# Altium project UC-523.PrjPCB (part 2 of 3)

## Sheet LED_Driver - 4.SchDoc
size A3
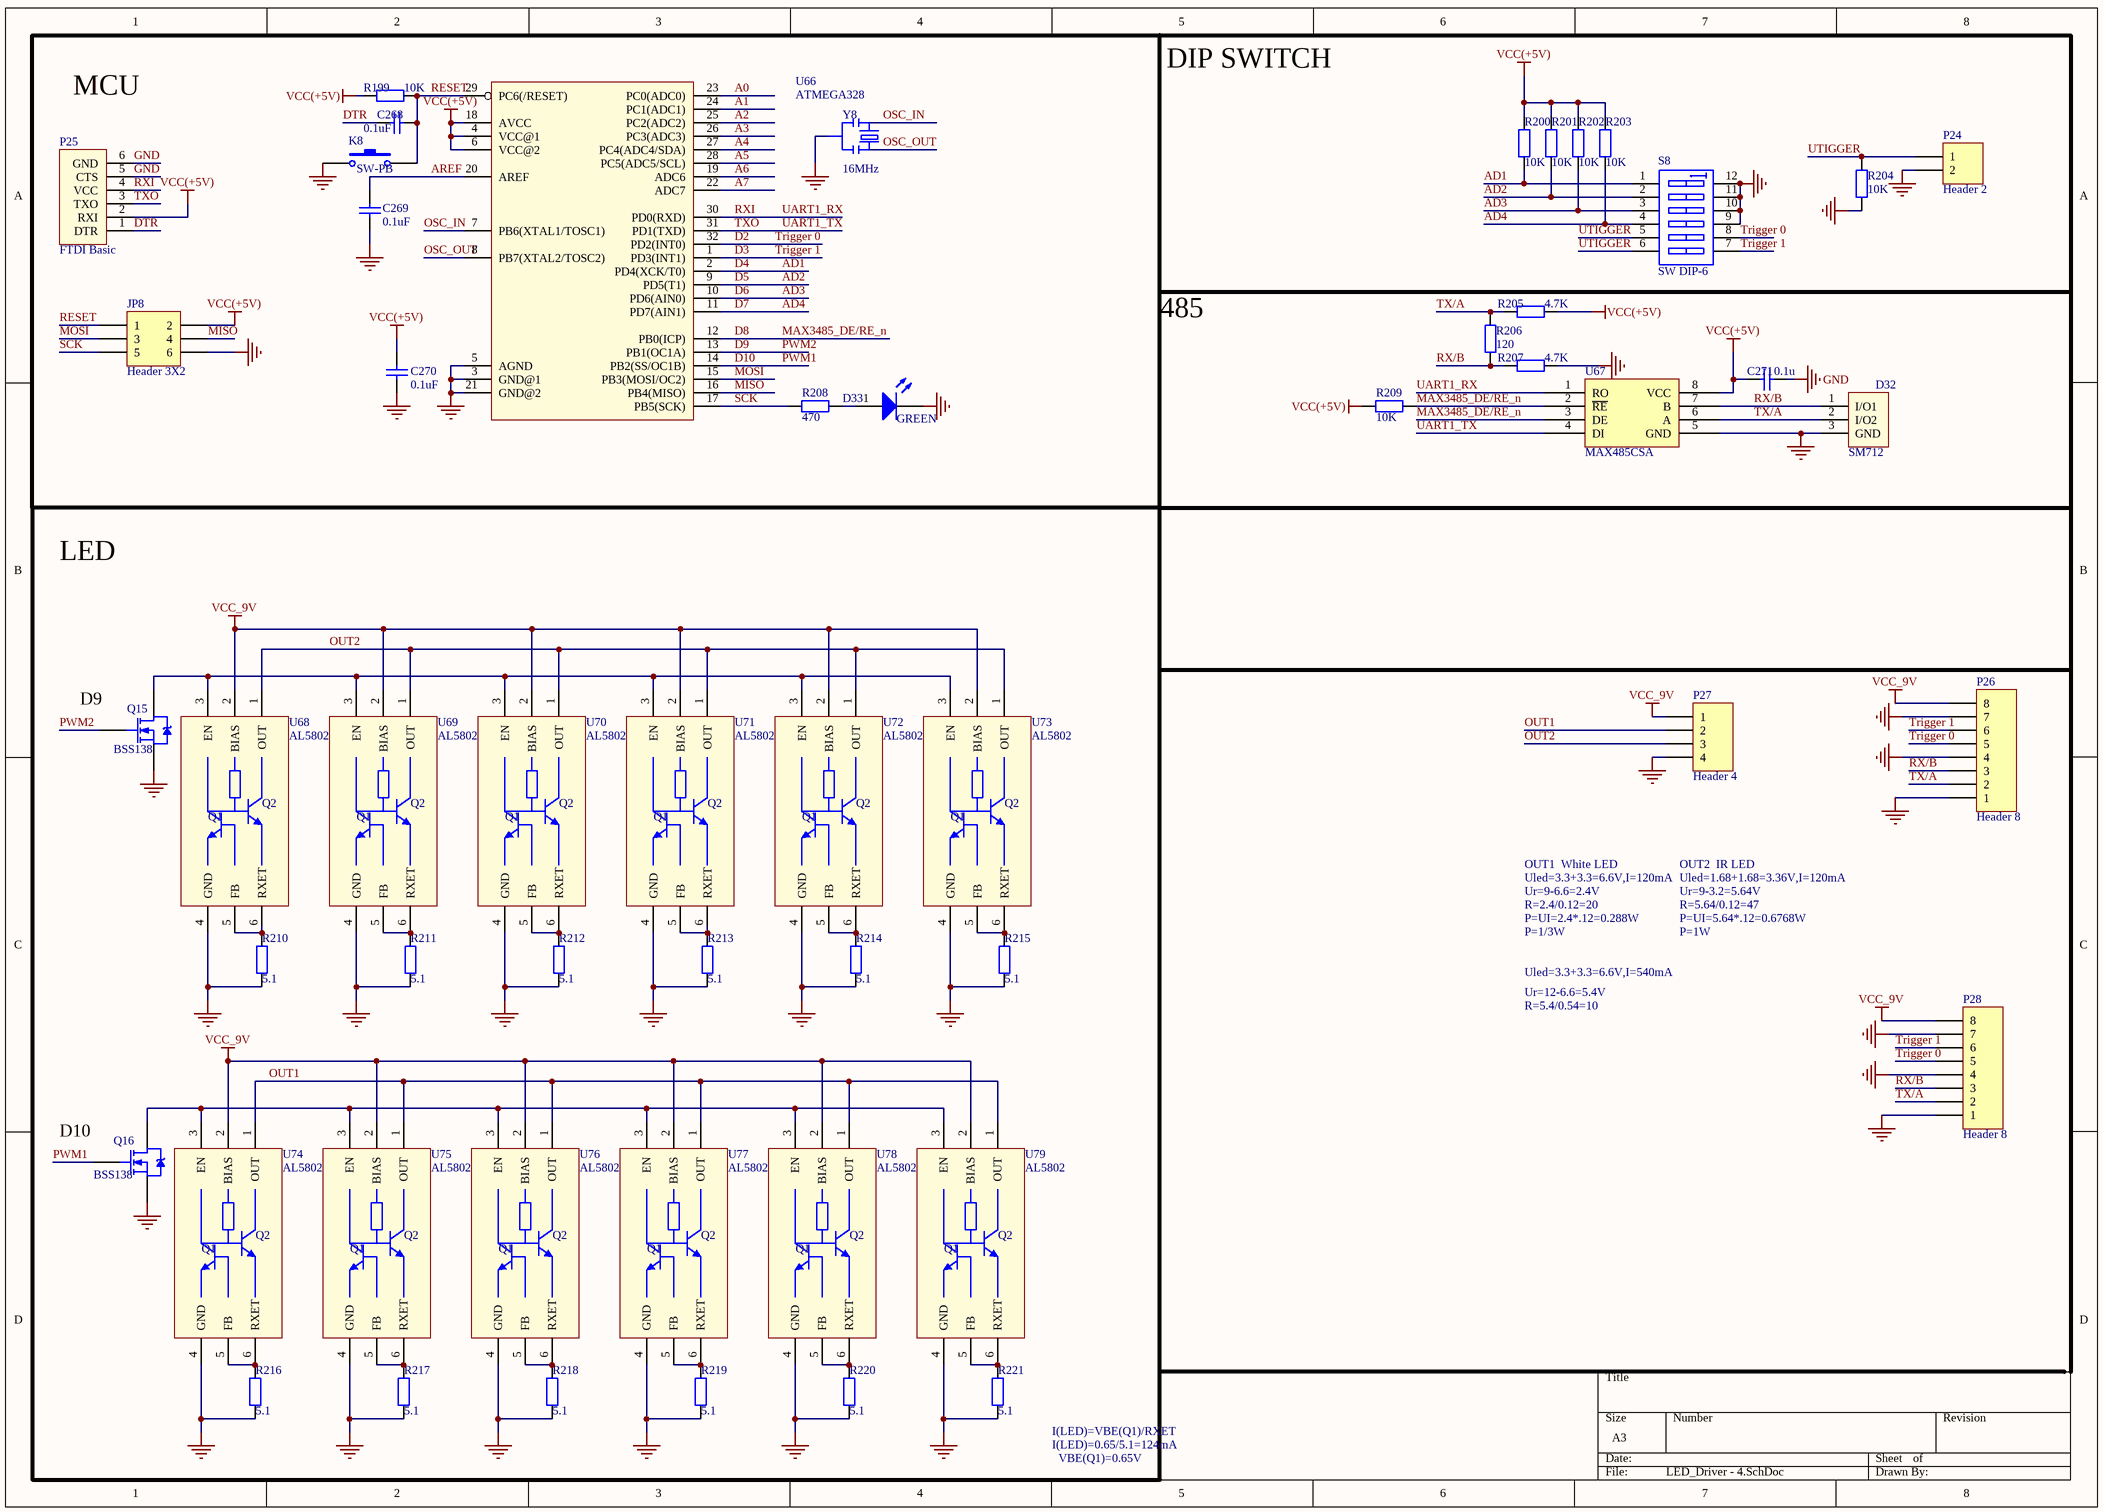
[diagram p5: LED_Driver - 4.SchDoc]

### Parts
C268  0.1uF  [C0603]
C269  0.1uF  [C0603]
C270  0.1uF  [C0603]
C271  0.1u  [C0603]
D32  SM712  [SOT23-3]
D33  GREEN  [LED0805]
JP8  Header 3X2  [MHDR1X6]
K8  SW-PB  [157SW]
P24  Header 2  [HDR1X2]
P25  FTDI Basic  [MHDR1X6]
P26  Header 8  [SH_1.25MM*8]
P27  Header 4  [SMT_1.25MM*4]
P28  Header 8  [SH_1.25MM*8]
Q15  BSS138  [SOT-23 (Standard)]
Q16  BSS138  [SOT-23 (Standard)]
R199  10K  [R0603]
R200  10K  [R0603]
R201  10K  [R0603]
R202  10K  [R0603]
R203  10K  [R0603]
R204  10K  [R0603]
R205  4.7K  [R0603]
R206  120  [R0603]
R207  4.7K  [R0603]
R208  470  [R0603]
R209  10K  [R0603]
R210  5.1  [R0603]
R211  5.1  [R0603]
R212  5.1  [R0603]
R213  5.1  [R0603]
R214  5.1  [R0603]
R215  5.1  [R0603]
R216  5.1  [R0603]
R217  5.1  [R0603]
R218  5.1  [R0603]
R219  5.1  [R0603]
R220  5.1  [R0603]
R221  5.1  [R0603]
S8  SW DIP-6  [DIP_SW_6WAY_SMD]
U66  ATMEGA328  [TQFP32-08]
U67  MAX485CSA  [SOIC-8]
U68  AL5802  [SOT26]
U69  AL5802  [SOT26]
U70  AL5802  [SOT26]
U71  AL5802  [SOT26]
U72  AL5802  [SOT26]
U73  AL5802  [SOT26]
U74  AL5802  [SOT26]
U75  AL5802  [SOT26]
U76  AL5802  [SOT26]
U77  AL5802  [SOT26]
U78  AL5802  [SOT26]
U79  AL5802  [SOT26]
Y8  16MHz  [RESONATOR-SMD]

### Blocks framed on the sheet
LED: Q15 Q16 R210-R221 U68-U79

### Nets
GND: C269.1 C270.2 C271.1 D32.3(GND) D33.2(K) JP8.6 K8.1 P24.2 P25.5(CTS) P25.6(GND) P26.1 P26.4 P26.7 P27.4 P28.1 P28.4 P28.7 Q15.S Q16.S R204.1 R207.1 R210.2 R211.2 R212.2 R213.2 R214.2 R215.2 R216.2 R217.2 R218.2 R219.2 R220.2 R221.2 S8.9(B4) S8.10(B3) S8.11(B2) S8.12(B1) U66.3(GND@1) U66.5(AGND) U66.21(GND@2) U67.5(GND) U68.4(GND) U69.4(GND) U70.4(GND) U71.4(GND) U72.4(GND) U73.4(GND) U74.4(GND) U75.4(GND) U76.4(GND) U77.4(GND) U78.4(GND) U79.4(GND) Y8.2
VCC(+5V): C270.1 C271.2 JP8.2 P25.2(RXI) R199.1 R200.1 R201.1 R202.1 R203.1 R205.1 R209.2 U66.4(VCC@1) U66.6(VCC@2) U66.18(AVCC) U67.8(VCC)
VCC_9V: P26.8 P27.1 P28.8 U68.2(BIAS) U69.2(BIAS) U70.2(BIAS) U71.2(BIAS) U72.2(BIAS) U73.2(BIAS) U74.2(BIAS) U75.2(BIAS) U76.2(BIAS) U77.2(BIAS) U78.2(BIAS) U79.2(BIAS)
A0: U66.23(PC0(ADC0))
A1: U66.24(PC1(ADC1))
A2: U66.25(PC2(ADC2))
A3: U66.26(PC3(ADC3))
A4: U66.27(PC4(ADC4/SDA))
A5: U66.28(PC5(ADC5/SCL))
A6: U66.19(ADC6)
A7: U66.22(ADC7)
AD1: R200.2 S8.1(A1) U66.2(PD4(XCK/T0))  [also labelled D4]
AD2: R201.2 S8.2(A2) U66.9(PD5(T1))  [also labelled D5]
AD3: R202.2 S8.3(A3) U66.10(PD6(AIN0))  [also labelled D6]
AD4: R203.2 S8.4(A4) U66.11(PD7(AIN1))  [also labelled D7]
AREF: C269.2 U66.20(AREF)
D2: P26.5 P28.5 S8.8(B5) U66.32(PD2(INT0))  [also labelled Trigger 0]
D3: P26.6 P28.6 S8.7(B6) U66.1(PD3(INT1))  [also labelled Trigger 1]
D8: R209.1 U66.12(PB0(ICP)) U67.2(~{RE}) U67.3(DE)  [also labelled MAX3485_DE/RE_n]
D9: Q15.G U66.13(PB1(OC1A))  [also labelled PWM2]
D10: Q16.G U66.14(PB2(SS/OC1B))  [also labelled PWM1]
DTR: C268.1 P25.1(DTR)
MISO: JP8.4 U66.16(PB4(MISO))
MOSI: JP8.3 U66.15(PB3(MOSI/OC2))
OSC_IN: U66.7(PB6(XTAL1/TOSC1)) Y8.3
OSC_OUT: U66.8(PB7(XTAL2/TOSC2)) Y8.1
OUT1: P27.2 U74.1(OUT) U75.1(OUT) U76.1(OUT) U77.1(OUT) U78.1(OUT) U79.1(OUT)
OUT2: P27.3 U68.1(OUT) U69.1(OUT) U70.1(OUT) U71.1(OUT) U72.1(OUT) U73.1(OUT)
RESET: C268.2 JP8.1 K8.2 R199.2 U66.29(PC6(/RESET))
RX/B: D32.1(I/O1) P26.3 P28.3 R206.2 R207.2 U67.7(B)
RXI: P25.4(VCC) U66.30(PD0(RXD)) U67.1(RO)  [also labelled UART1_RX]
SCK: JP8.5 R208.1 U66.17(PB5(SCK))
TX/A: D32.2(I/O2) P26.2 P28.2 R205.2 R206.1 U67.6(A)
TXO: P25.3(TXO) U66.31(PD1(TXD)) U67.4(DI)  [also labelled UART1_TX]
UTIGGER: P24.1 R204.2 S8.5(A5) S8.6(A6)
NetD33_1: D33.1(A) R208.2
NetQ15_D: Q15.D U68.3(EN) U69.3(EN) U70.3(EN) U71.3(EN) U72.3(EN) U73.3(EN)
NetQ16_D: Q16.D U74.3(EN) U75.3(EN) U76.3(EN) U77.3(EN) U78.3(EN) U79.3(EN)
NetR210_1: R210.1 U68.5(FB) U68.6(RXET)
NetR211_1: R211.1 U69.5(FB) U69.6(RXET)
NetR212_1: R212.1 U70.5(FB) U70.6(RXET)
NetR213_1: R213.1 U71.5(FB) U71.6(RXET)
NetR214_1: R214.1 U72.5(FB) U72.6(RXET)
NetR215_1: R215.1 U73.5(FB) U73.6(RXET)
NetR216_1: R216.1 U74.5(FB) U74.6(RXET)
NetR217_1: R217.1 U75.5(FB) U75.6(RXET)
NetR218_1: R218.1 U76.5(FB) U76.6(RXET)
NetR219_1: R219.1 U77.5(FB) U77.6(RXET)
NetR220_1: R220.1 U78.5(FB) U78.6(RXET)
NetR221_1: R221.1 U79.5(FB) U79.6(RXET)

### Notes on the sheet
- MCU
- DIP SWITCH
- 485
- (near Q15) D9
- Uled=3.3+3.3=6.6V,I=120mA
- OUT1  White LED
- R=2.4/0.12=20
- P=UI=2.4*.12=0.288W
- Ur=9-6.6=2.4V
- Uled=1.68+1.68=3.36V,I=120mA
- OUT2  IR LED
- R=5.64/0.12=47
- P=UI=5.64*.12=0.6768W
- Ur=9-3.2=5.64V
- P=1/3W
- Uled=3.3+3.3=6.6V,I=540mA
- Ur=12-6.6=5.4V
- P=1W
- R=5.4/0.54=10
- (near Q16) D10
- I(LED)=VBE(Q1)/RXET
- I(LED)=0.65/5.1=124mA
- VBE(Q1)=0.65V
- (in symbol AL5802) Q2; Q1

### Library data of the parts
C268-C270 = CAP SMT C100nF25V10%X7R: Capacitor; Voltage: 25V; iPartNumber: C100nF25V10%X7R; Value: 0.1uF
C271 = Cap: Capacitor; Value: 100pF; Published: 8-Jun-2000; LatestRevisionDate: 17-Jul-2002; LatestRevisionNote: Re-released for DXP Platform.; PackageReference: RAD-0.3; Publisher: Altium Limited
D33 = LED0: Typical INFRARED GaAs LED; Published: 8-Jun-2000; LatestRevisionDate: 08-Jul-2005; LatestRevisionNote: Mech Layer 1 removed.; PackageReference: LED-0; Publisher: Altium Limited
JP8 = Header 3X2: Header, 3-Pin, Dual row; LatestRevisionDate: 17-Jul-2002; LatestRevisionNote: Re-released for DXP Platform.; Publisher: Altium Limited
K8 = SW-PB: Switch; Published: 24-Mar-1999; LatestRevisionDate: 17-Jul-2002; LatestRevisionNote: Re-released for DXP Platform.; PackageReference: SPST-2; Publisher: Altium Limited; PackageDescription: Switch; 2 Leads
P24 = Header 2: Header, 2-Pin; LatestRevisionDate: 17-Jul-2002; LatestRevisionNote: Re-released for DXP Platform.; Publisher: Altium Limited
P25 = ARDUINO_SERIAL_PROGRAMPTH
P26 P28 = Header 8: Header, 8-Pin; LatestRevisionDate: 17-Jul-2002; LatestRevisionNote: Re-released for DXP Platform.; Publisher: Altium Limited
P27 = Header 4: Header, 4-Pin; LatestRevisionDate: 17-Jul-2002; LatestRevisionNote: Re-released for DXP Platform.; Publisher: Altium Limited
Q15 Q16 = NMOS: Manufacturer: Fairchild Semiconductor; Manufacturer Part Number: BSS123; FET Type: MOSFET N-Channel, Metal Oxide; FET Feature: Logic Level Gate; Drain to Source Voltage (Vdss): 100V; Current - Continuous Drain (Id) @ 25°C: 170mA (Ta); Rds On (Max) @ Id, Vgs: 6 Ohm @ 170mA, 10V; Vgs(th) (Max) @ Id: 2V @ 1mA; Gate Charge (Qg) @ Vgs: 2.5nC @ 10V; Input Capacitance (Ciss) @ Vds: 73pF @ 25V; Power - Max: 360mW; Supplier 1: Digi-Key; Supplier Part Number 1: BSS123NCT-ND; RoHS: RoHS Compliant; Category: Discrete Semiconductor Products; Stock 1: 163946; Pricing 1: 1=0.24, 10=0.216, 25=0.1556, 100=0.1211, 250=0.07612, 500=0.06484, 1000=0.04418 (USD); Packaging: Cut Tape (CT); Mounting Type: Surface Mount; Package / Case: TO-236-3, SC-59, SOT-23-3; Supplier Device Package: SOT-23; ComponentLink1URL: http://www.fairchildsemi.com/datasheets/BS/BSS123.pdf; ComponentLink1Description: http://www.fairchildsemi.com/datasheets/BS/BSS123.pdf
R199-R203 R205-R221 = Res2: Resistor
R204 = Res2: Resistor; Value: 1k; Published: 8-Jun-2000; LatestRevisionDate: 17-Jul-2002; LatestRevisionNote: Re-released for DXP Platform.; PackageReference: AXIAL-0.4; Publisher: Altium Limited
S8 = SW DIP-6: DIP Switch, 6 Position, SPST; Published: 24-Mar-1999; LatestRevisionDate: 17-Jul-2002; LatestRevisionNote: Re-released for DXP Platform.; PackageReference: DIP-12/SW; Publisher: Altium Limited
U66 = ATMEGA168
U67 = MAX3485CSA
Y8 = RESONATORSMD

## Sheet Cyusb3314_Power.SchDoc
size 386 x 284 mm
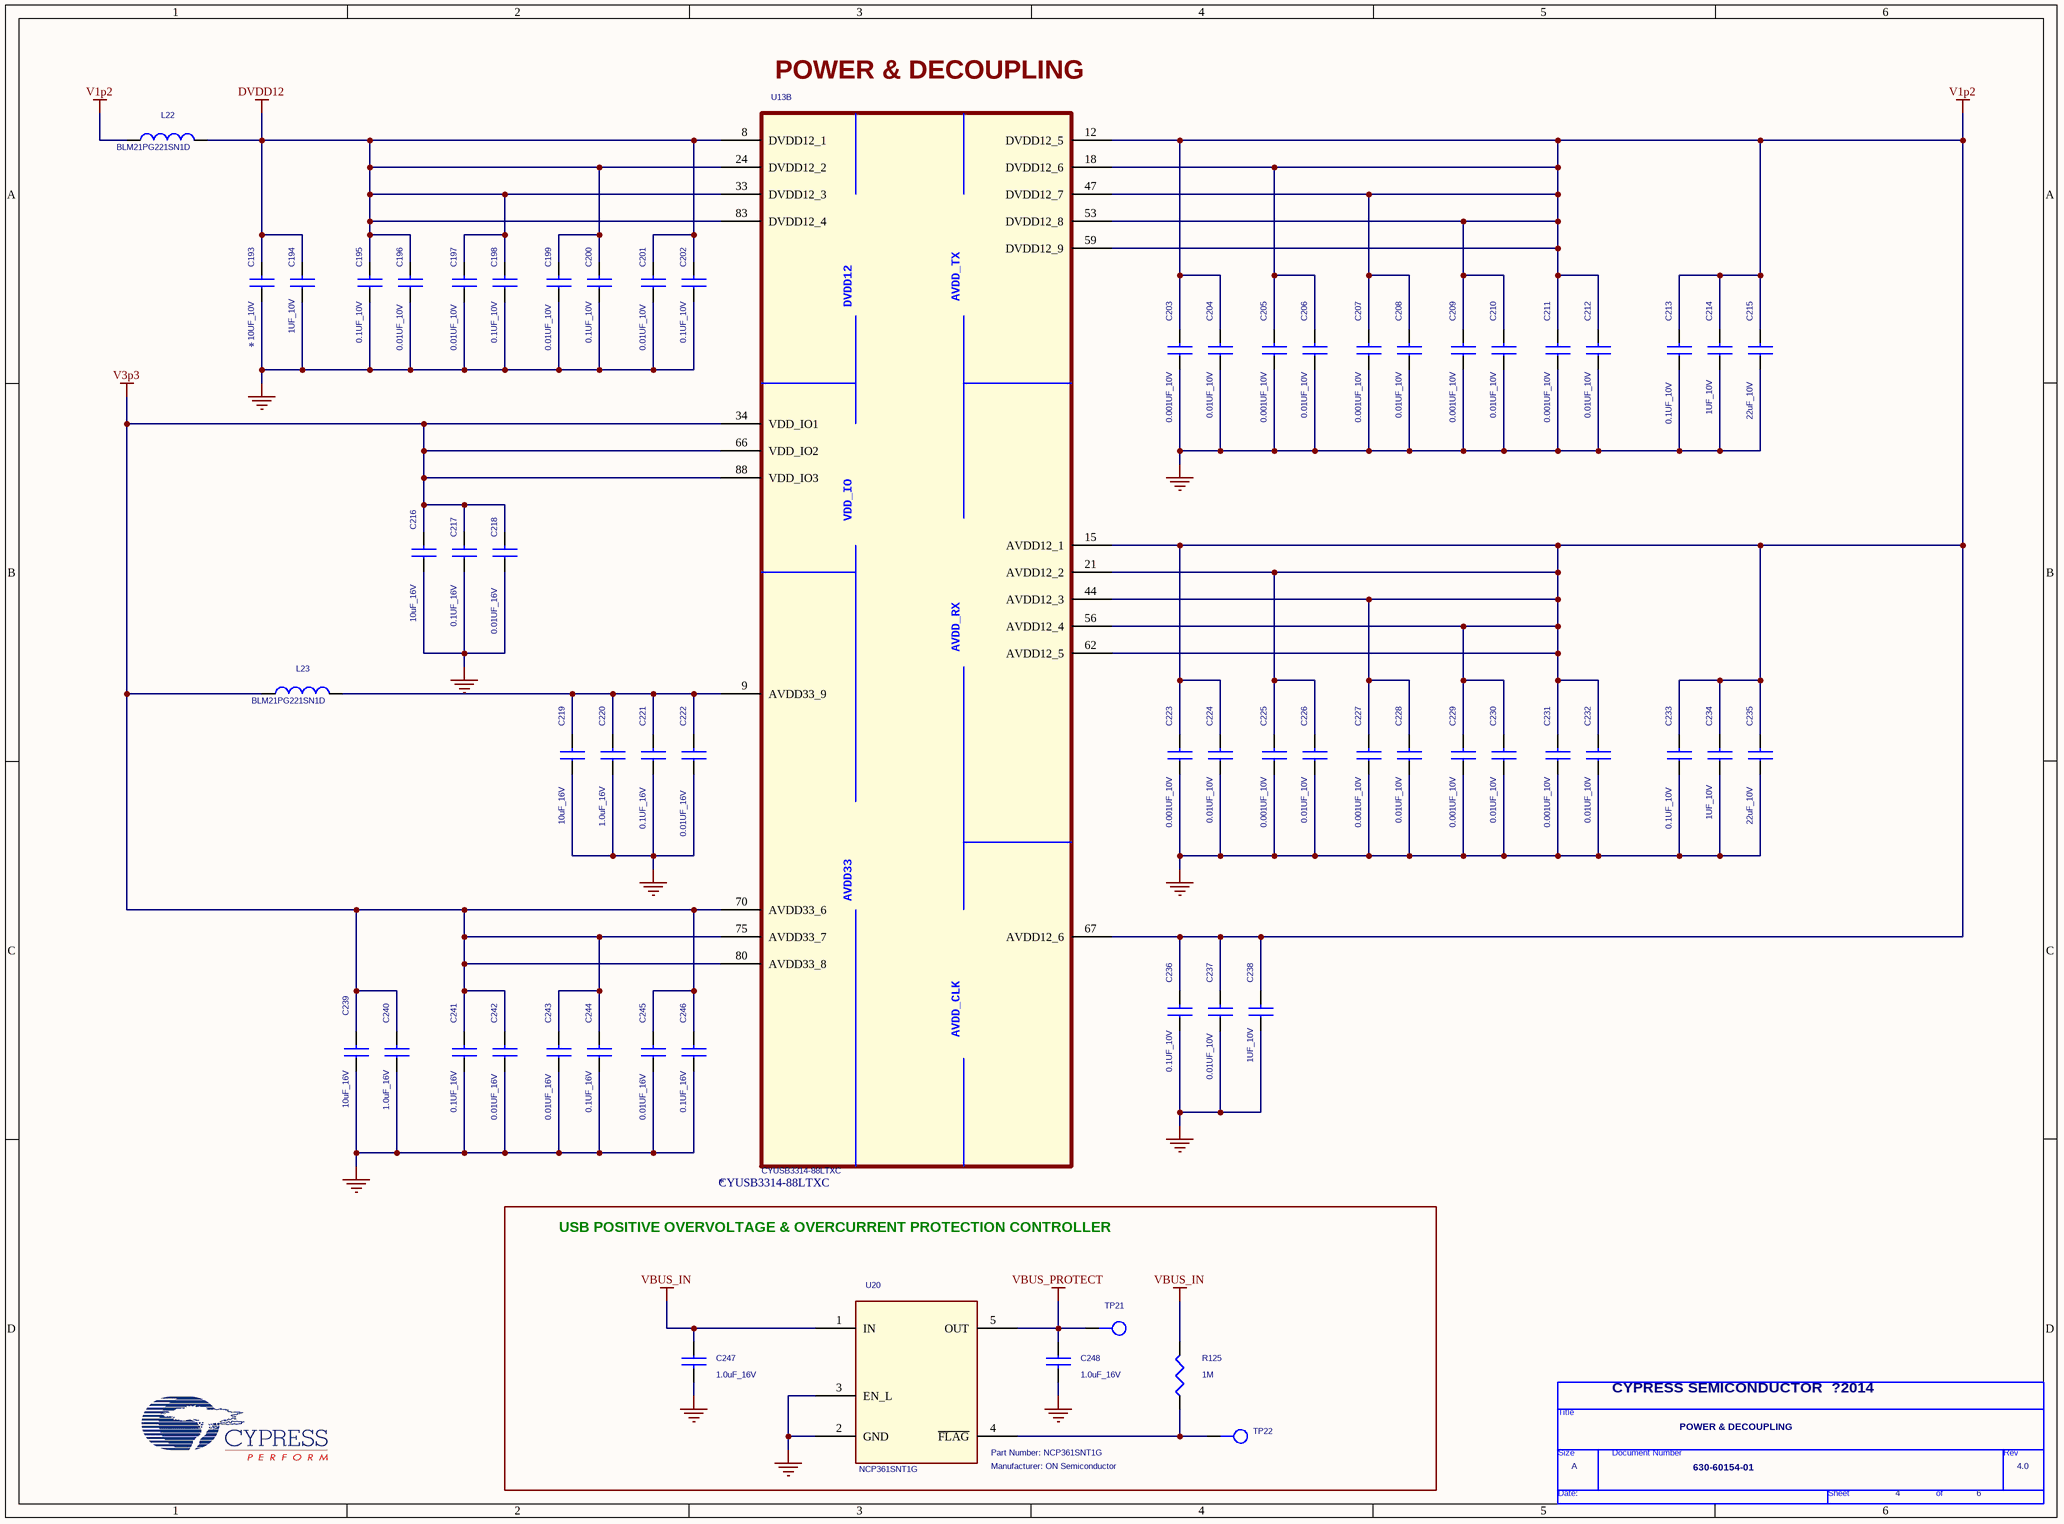
[diagram p6: Cyusb3314_Power.SchDoc]

### Parts
(Parts that share a designator on the sheet are numbered #1, #2 ... from top to bottom, then left to right.)
*#1  Page Count: 6  Page Number: 4  Page Size: A  Title: POWER & DECOUPLING  RevCode: 4.0  Doc: 630-60154-01  (hidden comment: TitleBlock0)  (graphical)
C193  10UF_10V  [CAPC1608X90M]
C194  1UF_10V  [CAPC1005X56M]
C195  0.1UF_10V  [CAPC1005X56M]
C196  0.01UF_10V  [CAPC1005X56M]
C197  0.01UF_10V  [CAPC1005X56M]
C198  0.1UF_10V  [CAPC1005X56M]
C199  0.01UF_10V  [CAPC1005X56M]
C200  0.1UF_10V  [CAPC1005X56M]
C201  0.01UF_10V  [CAPC1005X56M]
C202  0.1UF_10V  [CAPC1005X56M]
C203  0.001UF_10V  [CAPC1005X56M]
C204  0.01UF_10V  [CAPC1005X56M]
C205  0.001UF_10V  [CAPC1005X56M]
C206  0.01UF_10V  [CAPC1005X56M]
C207  0.001UF_10V  [CAPC1005X56M]
C208  0.01UF_10V  [CAPC1005X56M]
C209  0.001UF_10V  [CAPC1005X56M]
C210  0.01UF_10V  [CAPC1005X56M]
C211  0.001UF_10V  [CAPC1005X56M]
C212  0.01UF_10V  [CAPC1005X56M]
C213  0.1UF_10V  [CAPC1005X56M]
C214  1UF_10V  [CAPC1005X56M]
C215  22uF_10V  [CAPC1608X90M]
C216  10uF_16V  [CAPC1608X90M]
C217  0.1UF_16V  [CAPC1005X56M]
C218  0.01UF_16V  [CAPC1005X56M]
C219  10uF_16V  [CAPC1608X90M]
C220  1.0uF_16V  [CAPC1005X56M]
C221  0.1UF_16V  [CAPC1005X56M]
C222  0.01UF_16V  [CAPC1005X56M]
C223  0.001UF_10V  [CAPC1005X56M]
C224  0.01UF_10V  [CAPC1005X56M]
C225  0.001UF_10V  [CAPC1005X56M]
C226  0.01UF_10V  [CAPC1005X56M]
C227  0.001UF_10V  [CAPC1005X56M]
C228  0.01UF_10V  [CAPC1005X56M]
C229  0.001UF_10V  [CAPC1005X56M]
C230  0.01UF_10V  [CAPC1005X56M]
C231  0.001UF_10V  [CAPC1005X56M]
C232  0.01UF_10V  [CAPC1005X56M]
C233  0.1UF_10V  [CAPC1005X56M]
C234  1UF_10V  [CAPC1005X56M]
C235  22uF_10V  [CAPC1608X90M]
C236  0.1UF_10V  [CAPC1005X56M]
C237  0.01UF_10V  [CAPC1005X56M]
C238  1UF_10V  [CAPC1005X56M]
C239  10uF_16V  [CAPC1608X90M]
C240  1.0uF_16V  [CAPC1005X56M]
C241  0.1UF_16V  [CAPC1005X56M]
C242  0.01UF_16V  [CAPC1005X56M]
C243  0.01UF_16V  [CAPC1005X56M]
C244  0.1UF_16V  [CAPC1005X56M]
C245  0.01UF_16V  [CAPC1005X56M]
C246  0.1UF_16V  [CAPC1005X56M]
C247  1.0uF_16V  [CAPC1608X90M]
C248  1.0uF_16V  [CAPC1608X90M]
L22  BLM21PG221SN1D  [INDC2012X105M]
L23  BLM21PG221SN1D  [INDC2012X105M]
R125  1M  [RESC1005X40M]
TP21  TP_RED  [KEYSTONE_5000]  (value not drawn)
TP22  TP_YEL  [KEYSTONE_5000]  (value not drawn)
U13  CYUSB3314-88LTXC  [QFN40P1000X1000X100-89M]  (part B of 3)
U20  NCP361SNT1G  Manufacturer: ON Semiconductor  [SOP95P275X110-5M]

### Blocks framed on the sheet
USB POSITIVE OVERVOLTAGE & OVERCURRENT PROTECTION CONTROLLER: C247 C248 R125 TP21 TP22 U20

### Nets
DVDD12: C193.2 C194.2 C195.2 C196.2 C197.2 C198.2 C199.2 C200.2 C201.2 C202.2 L22.2 U13.8(DVDD12_1) U13.24(DVDD12_2) U13.33(DVDD12_3) U13.83(DVDD12_4)
GND: C193.1 C194.1 C195.1 C196.1 C197.1 C198.1 C199.1 C200.1 C201.1 C202.1 C203.1 C204.1 C205.1 C206.1 C207.1 C208.1 C209.1 C210.1 C211.1 C212.1 C213.1 C214.1 C215.1 C216.1 C217.1 C218.1 C219.1 C220.1 C221.1 C222.1 C223.1 C224.1 C225.1 C226.1 C227.1 C228.1 C229.1 C230.1 C231.1 C232.1 C233.1 C234.1 C235.1 C236.1 C237.1 C238.1 C239.1 C240.1 C241.1 C242.1 C243.1 C244.1 C245.1 C246.1 C247.2 C248.2 U20.2(GND) U20.3(EN_L)
V1p2: C203.2 C204.2 C205.2 C206.2 C207.2 C208.2 C209.2 C210.2 C211.2 C212.2 C213.2 C214.2 C215.2 C223.2 C224.2 C225.2 C226.2 C227.2 C228.2 C229.2 C230.2 C231.2 C232.2 C233.2 C234.2 C235.2 C236.2 C237.2 C238.2 L22.1 U13.12(DVDD12_5) U13.15(AVDD12_1) U13.18(DVDD12_6) U13.21(AVDD12_2) U13.44(AVDD12_3) U13.47(DVDD12_7) U13.53(DVDD12_8) U13.56(AVDD12_4) U13.59(DVDD12_9) U13.62(AVDD12_5) U13.67(AVDD12_6)
V3p3: C216.2 C217.2 C218.2 C239.2 C240.2 C241.2 C242.2 C243.2 C244.2 C245.2 C246.2 L23.1 U13.34(VDD_IO1) U13.66(VDD_IO2) U13.70(AVDD33_6) U13.75(AVDD33_7) U13.80(AVDD33_8) U13.88(VDD_IO3)  [project net VCC(+3.3V)]
VBUS_IN: C247.1 R125.2 U20.1(IN)
VBUS_PROTECT: C248.1 TP21.1(TP) U20.5(OUT)
NetC219_2: C219.2 C220.2 C221.2 C222.2 L23.2 U13.9(AVDD33_9)
NetR125_1: R125.1 TP22.1(TP) U20.4(~{FLAG})

### Notes on the sheet
- POWER & DECOUPLING
- CYPRESS SEMICONDUCTOR  ?2014
- (in symbol CYUSB3314-88LTXC_2, part B) AVDD_TX; DVDD12; VDD_IO; AVDD_RX; AVDD33; AVDD_CLK
- (in symbol TitleBlock0) Title; Size; Document Number; Rev; Date:; Sheet; of

### Library data of the parts
C193-C246 = CAPACITOR NON-POL: Manufacturer: *; Part Number: *
  C196: Decription: *
C247 C248 = CAP: CAP - CER, 1uF, 10V, +/-10%, X5R, 0402; Part Class: CAPACITORS; Num Pins: 2; Item Num: P03-15479R; RoHS Compliant: Yes; Lead Free Status: Yes
L22 L23 = INDUCTOR: FERRITE CHIP 220 OHM 2A 0805; Manufacturer: Murata; DEVICE: L4; Part Number: BLM21PG221SN1D; Lead Free: YES
R125 = R: RES 1.00M OHM 1/10W 1% 0402 SMD; Manufacturer: Panasonic; Part Number: ERJ-2RKF1004X
TP21 = TP: TEST POINT PC MINI .040"D RED; PART_NUMBER: 5000; Manufacturer: Keystone
TP22 = TP: TEST POINT PC MINI .040"D RED; Manufacturer: Keystone; PART_NUMBER: 5000
U13 = CYUSB3314-88LTXC_2: Manufacturer: *; Part Number: CYUSB3314-88LTXC
U20 = NCP361SNT1G_0: IC USB POS OVP/OC_TSOP5; Part Number: NCP361SNT1G
*#1 = TitleBlock0: Page Create Date: March  8, 1995

## Sheet Cyusb3314_Interface.SchDoc
size 401 x 330 mm
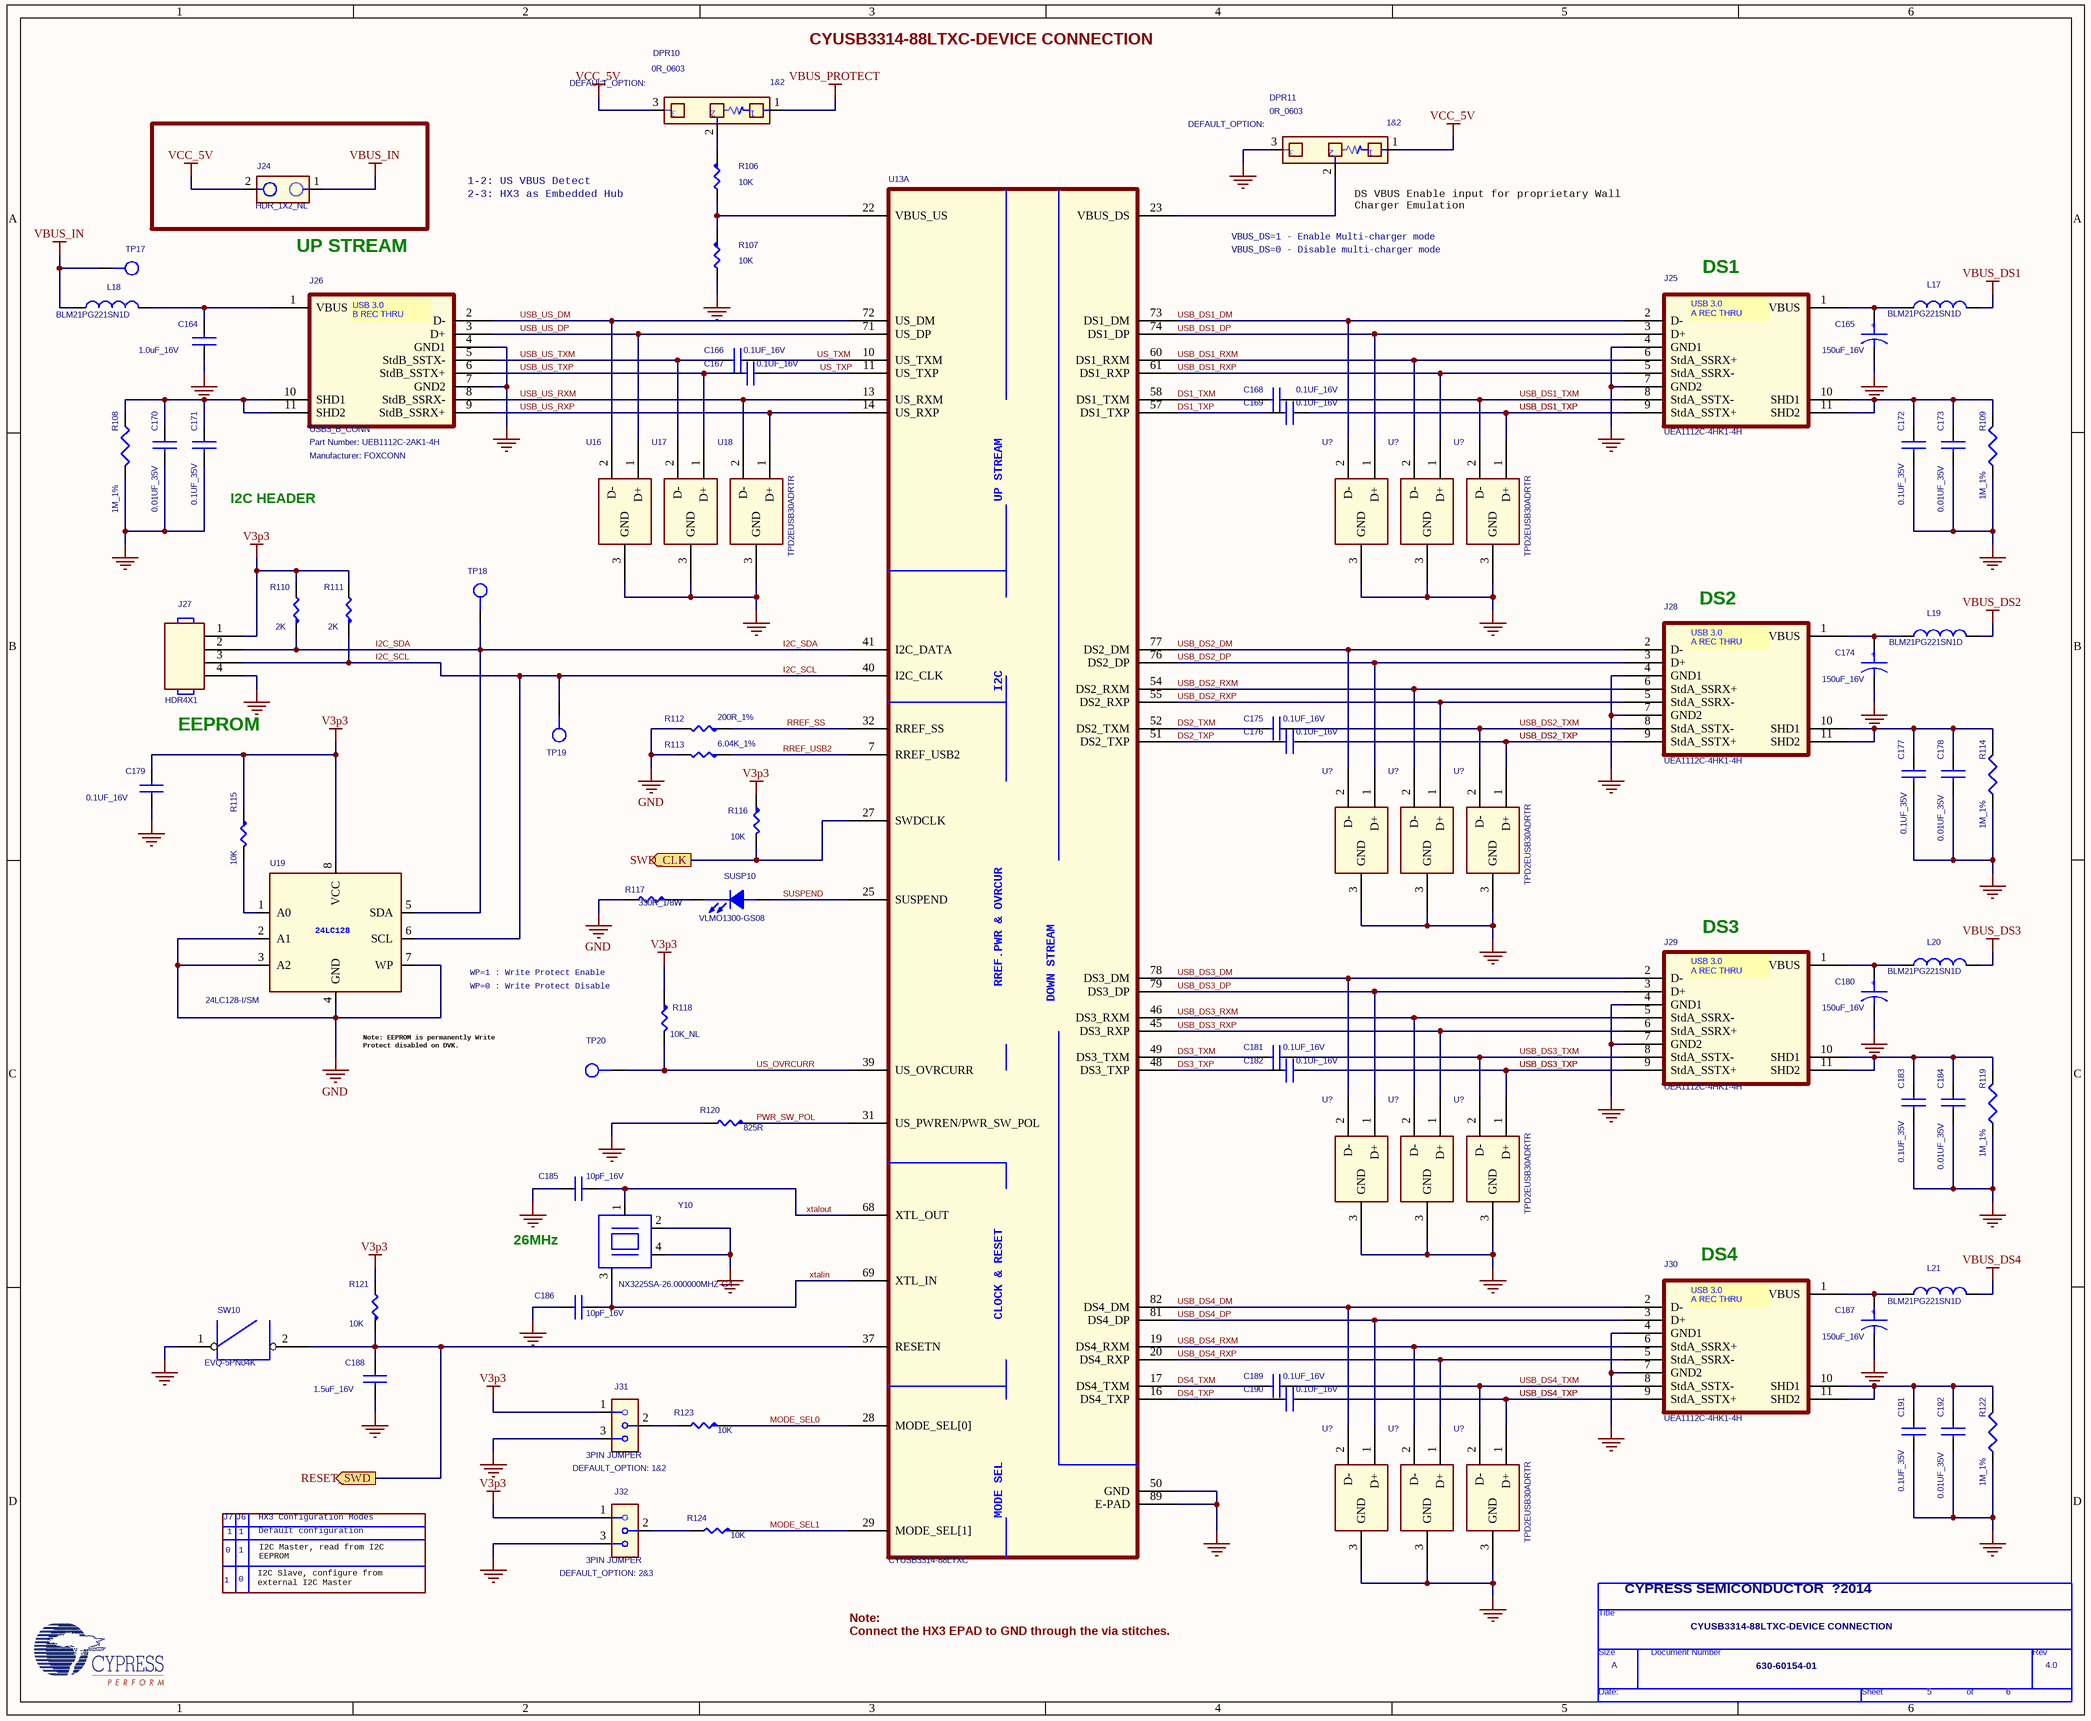
[diagram p7: Cyusb3314_Interface.SchDoc]

### Parts
(Parts that share a designator on the sheet are numbered #1, #2 ... from top to bottom, then left to right.)
*#2  Page Count: 6  Page Number: 5  Page Size: A  Title: CYUSB3314-88LTXC-DEVICE CONNECTION  RevCode: 4.0  Doc: 630-60154-01  (hidden comment: TitleBlock0)  (graphical)
C164  1.0uF_16V  [CAPC1005X56M]
C165  150uF_16V  [CAPAE660X800M]
C166  0.1UF_16V  [CAPC1005X56M]
C167  0.1UF_16V  [CAPC1005X56M]
C168  0.1UF_16V  [CAPC1005X56M]
C169  0.1UF_16V  [CAPC1005X56M]
C170  0.01UF_35V  [CAPC1005X55M]
C171  0.1UF_35V  [CAPC1005X55M]
C172  0.1UF_35V  [CAPC1005X55M]
C173  0.01UF_35V  [CAPC1005X55M]
C174  150uF_16V  [CAPAE660X800M]
C175  0.1UF_16V  [CAPC1005X56M]
C176  0.1UF_16V  [CAPC1005X56M]
C177  0.1UF_35V  [CAPC1005X55M]
C178  0.01UF_35V  [CAPC1005X55M]
C179  0.1UF_16V  [CAPC1005X56M]
C180  150uF_16V  [CAPAE660X800M]
C181  0.1UF_16V  [CAPC1005X56M]
C182  0.1UF_16V  [CAPC1005X56M]
C183  0.1UF_35V  [CAPC1005X55M]
C184  0.01UF_35V  [CAPC1005X55M]
C185  10pF_16V  [CAPC1608X90M]
C186  10pF_16V  [CAPC1608X90M]
C187  150uF_16V  [CAPAE660X800M]
C188  1.5uF_16V  [CAPC1608X90M]
C189  0.1UF_16V  [CAPC1005X56M]
C190  0.1UF_16V  [CAPC1005X56M]
C191  0.1UF_35V  [CAPC1005X55M]
C192  0.01UF_35V  [CAPC1005X55M]
DPR10  0R_0603  Mounting Status: 1&2  [RC0603_3P]
DPR11  0R_0603  Mounting Status: 1&2  [RC0603_3P]
J24  HDR_1X2_NL  [SAMTEC_TSW-102-08-G-S]
J25  UEA1112C-4HK1-4H  [FOXCONN_UEA1112C-4HK1-4H]
J26  USB3_B_CONN  Manufacturer: FOXCONN  [FOXCONN_UEB1112C-2AK1-4H]
J27  HDR4X1  [SAMTEC_TSW-104-08-G-S]
J28  UEA1112C-4HK1-4H  [FOXCONN_UEA1112C-4HK1-4H]
J29  UEA1112C-4HK1-4H  [FOXCONN_UEA1112C-4HK1-4H]
J30  UEA1112C-4HK1-4H  [FOXCONN_UEA1112C-4HK1-4H]
J31  3PIN JUMPER  DEFAULT_OPTION: 1&2  [TE_3-644456-3]
J32  3PIN JUMPER  DEFAULT_OPTION: 2&3  [TE_3-644456-3]
L17  BLM21PG221SN1D  [INDC2012X105M]
L18  BLM21PG221SN1D  [INDC2012X105M]
L19  BLM21PG221SN1D  [INDC2012X105M]
L20  BLM21PG221SN1D  [INDC2012X105M]
L21  BLM21PG221SN1D  [INDC2012X105M]
R106  10K  [RESC1005X40M]
R107  10K  [RESC1005X40M]
R108  1M_1%  [RESC1608X55M]
R109  1M_1%  [RESC1608X55M]
R110  2K  [RESC1608X55M]
R111  2K  [RESC1608X55M]
R112  200R_1%  [RESC1608X50M]
R113  6.04K_1%  [RESC1608X55M_A]
R114  1M_1%  [RESC1608X55M]
R115  10K  [RESC1608X55M]
R116  10K  [RESC1005X40M]
R117  330R_1/8W  [RESC1608X50M]
R118  10K_NL  [RESC1005X40M]
R119  1M_1%  [RESC1608X55M]
R120  825R  [RESC1005X40M]
R121  10K  [RESC1608X55M]
R122  1M_1%  [RESC1608X55M]
R123  10K  [RESC1005X40M]
R124  10K  [RESC1005X40M]
SUSP10  VLMO1300-GS08  [LEDC1608X80M]
SW10  EVQ-5PN04K  [SW_EVQ-5PN04K]
TP17  TP_RED  [KEYSTONE_5000]  (value not drawn)
TP18  TP_YEL  [KEYSTONE_5000]  (value not drawn)
TP19  TP_YEL  [KEYSTONE_5000]  (value not drawn)
TP20  TP_YEL  [KEYSTONE_5000]  (value not drawn)
U13  CYUSB3314-88LTXC  [QFN40P1000X1000X100-89M]  (part A of 3)
U16  TPD2EUSB30ADRTR  [SOTFL35P100X50-3M]  (value not drawn)
U17  TPD2EUSB30ADRTR  [SOTFL35P100X50-3M]  (value not drawn)
U18  TPD2EUSB30ADRTR  [SOTFL35P100X50-3M]
U19  24LC128-I/SM  [SOIC127P790X203-8M]
U?#1  TPD2EUSB30ADRTR  [SOTFL35P100X50-3M]  (value not drawn)
U?#2  TPD2EUSB30ADRTR  [SOTFL35P100X50-3M]  (value not drawn)
U?#3  TPD2EUSB30ADRTR  [SOTFL35P100X50-3M]
U?#4  TPD2EUSB30ADRTR  [SOTFL35P100X50-3M]  (value not drawn)
U?#5  TPD2EUSB30ADRTR  [SOTFL35P100X50-3M]  (value not drawn)
U?#6  TPD2EUSB30ADRTR  [SOTFL35P100X50-3M]
U?#7  TPD2EUSB30ADRTR  [SOTFL35P100X50-3M]  (value not drawn)
U?#8  TPD2EUSB30ADRTR  [SOTFL35P100X50-3M]  (value not drawn)
U?#9  TPD2EUSB30ADRTR  [SOTFL35P100X50-3M]
U?#10  TPD2EUSB30ADRTR  [SOTFL35P100X50-3M]  (value not drawn)
U?#11  TPD2EUSB30ADRTR  [SOTFL35P100X50-3M]  (value not drawn)
U?#12  TPD2EUSB30ADRTR  [SOTFL35P100X50-3M]
Y10  NX3225SA-26.000000MHZ-G4  [OSCCC250X320X70-4M]

### Ports
RESET_SWD (out), SWD_CLK (out)

### Nets
GND: C164.1 C165.2 C170.2 C171.2 C172.2 C173.2 C174.2 C177.2 C178.2 C179.1 C180.2 C183.2 C184.2 C185.1 C186.1 C187.2 C188.2 C191.2 C192.2 DPR11.3 J25.4(GND1) J25.7(GND2) J26.4(GND1) J26.7(GND2) J27.4 J28.4(GND1) J28.7(GND2) J29.4(GND1) J29.7(GND2) J30.4(GND1) J30.7(GND2) J31.3 J32.3 R107.2 R108.2 R109.2 R112.2 R113.2 R114.2 R117.2 R119.2 R120.2 R122.2 SW10.1 U13.50(GND) U13.89(E-PAD) U16.3(GND) U17.3(GND) U18.3(GND) U19.2(A1) U19.3(A2) U19.4(GND) U19.7(WP) U?#1.3(GND) U?#2.3(GND) U?#3.3(GND) U?#4.3(GND) U?#5.3(GND) U?#6.3(GND) U?#7.3(GND) U?#8.3(GND) U?#9.3(GND) U?#10.3(GND) U?#11.3(GND) U?#12.3(GND) Y10.2 Y10.4
V3p3: C179.2 J27.1 J31.1 J32.1 R110.2 R111.2 R115.1 R116.1 R118.1 R121.2 U19.8(VCC)  [project net VCC(+3.3V)]
VBUS_DS1: L17.1
VBUS_DS2: L19.1
VBUS_DS3: L20.1
VBUS_DS4: L21.1
VBUS_IN: J24.1 L18.1 TP17.1(TP)
VBUS_PROTECT: DPR10.1
VCC_5V: DPR10.3 DPR11.1 J24.2  [project net VCC(+5V)]
DS1_TXM: C168.2 U13.58(DS1_TXM)
DS1_TXP: C169.2 U13.57(DS1_TXP)
DS2_TXM: C175.2 U13.52(DS2_TXM)
DS2_TXP: C176.2 U13.51(DS2_TXP)
DS3_TXM: C181.2 U13.49(DS3_TXM)
DS3_TXP: C182.2 U13.48(DS3_TXP)
DS4_TXM: C189.2 U13.17(DS4_TXM)
DS4_TXP: C190.2 U13.16(DS4_TXP)
I2C_SCL: J27.3 R111.1 TP19.1(TP) U13.40(I2C_CLK) U19.6(SCL)
I2C_SDA: J27.2 R110.1 TP18.1(TP) U13.41(I2C_DATA) U19.5(SDA)
MODE_SEL0: R123.1 U13.28(MODE_SEL[0])
MODE_SEL1: R124.1 U13.29(MODE_SEL[1])
PWR_SW_POL: R120.1 U13.31(US_PWREN/PWR_SW_POL)
RREF_SS: R112.1 U13.32(RREF_SS)
RREF_USB2: R113.1 U13.7(RREF_USB2)
SUSPEND: SUSP10.1(ANODE) U13.25(SUSPEND)
US_OVRCURR: R118.2 TP20.1(TP) U13.39(US_OVRCURR)
US_TXM: C166.1 U13.10(US_TXM)
US_TXP: C167.1 U13.11(US_TXP)
USB_DS1_DM: J25.2(D-) U13.73(DS1_DM) U?#1.2(D-)
USB_DS1_DP: J25.3(D+) U13.74(DS1_DP) U?#1.1(D+)
USB_DS1_RXM: J25.6(StdA_SSRX+) U13.60(DS1_RXM) U?#2.2(D-)
USB_DS1_RXP: J25.5(StdA_SSRX-) U13.61(DS1_RXP) U?#2.1(D+)
USB_DS1_TXM: C168.1 J25.8(StdA_SSTX-) U?#3.2(D-)
USB_DS1_TXP: C169.1 J25.9(StdA_SSTX+) U?#3.1(D+)
USB_DS2_DM: J28.2(D-) U13.77(DS2_DM) U?#4.2(D-)
USB_DS2_DP: J28.3(D+) U13.76(DS2_DP) U?#4.1(D+)
USB_DS2_RXM: J28.6(StdA_SSRX+) U13.54(DS2_RXM) U?#5.2(D-)
USB_DS2_RXP: J28.5(StdA_SSRX-) U13.55(DS2_RXP) U?#5.1(D+)
USB_DS2_TXM: C175.1 J28.8(StdA_SSTX-) U?#6.2(D-)
USB_DS2_TXP: C176.1 J28.9(StdA_SSTX+) U?#6.1(D+)
USB_DS3_DM: J29.2(D-) U13.78(DS3_DM) U?#7.2(D-)
USB_DS3_DP: J29.3(D+) U13.79(DS3_DP) U?#7.1(D+)
USB_DS3_RXM: J29.5(StdA_SSRX-) U13.46(DS3_RXM) U?#8.2(D-)
USB_DS3_RXP: J29.6(StdA_SSRX+) U13.45(DS3_RXP) U?#8.1(D+)
USB_DS3_TXM: C181.1 J29.8(StdA_SSTX-) U?#9.2(D-)
USB_DS3_TXP: C182.1 J29.9(StdA_SSTX+) U?#9.1(D+)
USB_DS4_DM: J30.2(D-) U13.82(DS4_DM) U?#10.2(D-)
USB_DS4_DP: J30.3(D+) U13.81(DS4_DP) U?#10.1(D+)
USB_DS4_RXM: J30.6(StdA_SSRX+) U13.19(DS4_RXM) U?#11.2(D-)
USB_DS4_RXP: J30.5(StdA_SSRX-) U13.20(DS4_RXP) U?#11.1(D+)
USB_DS4_TXM: C189.1 J30.8(StdA_SSTX-) U?#12.2(D-)
USB_DS4_TXP: C190.1 J30.9(StdA_SSTX+) U?#12.1(D+)
USB_US_DM: J26.2(D-) U13.72(US_DM) U16.2(D-)
USB_US_DP: J26.3(D+) U13.71(US_DP) U16.1(D+)
USB_US_RXM: J26.8(StdB_SSRX-) U13.13(US_RXM) U18.2(D-)
USB_US_RXP: J26.9(StdB_SSRX+) U13.14(US_RXP) U18.1(D+)
USB_US_TXM: C166.2 J26.5(StdB_SSTX-) U17.2(D-)
USB_US_TXP: C167.2 J26.6(StdB_SSTX+) U17.1(D+)
xtalin: C186.2 U13.69(XTL_IN) Y10.3
xtalout: C185.2 U13.68(XTL_OUT) Y10.1
NetC164_2: C164.2 J26.1(VBUS) L18.2
NetC165_1: C165.1 J25.1(VBUS) L17.2
NetC170_1: C170.1 C171.1 J26.10(SHD1) J26.11(SHD2) R108.1
NetC172_1: C172.1 C173.1 J25.10(SHD1) J25.11(SHD2) R109.1
NetC174_1: C174.1 J28.1(VBUS) L19.2
NetC177_1: C177.1 C178.1 J28.10(SHD1) J28.11(SHD2) R114.1
NetC180_1: C180.1 J29.1(VBUS) L20.2
NetC183_1: C183.1 C184.1 J29.10(SHD1) J29.11(SHD2) R119.1
NetC187_1: C187.1 J30.1(VBUS) L21.2
NetC188_1: C188.1 R121.1 SW10.2 U13.37(RESETN) ; port RESET_SWD
NetC191_1: C191.1 C192.1 J30.10(SHD1) J30.11(SHD2) R122.1
NetDPR10_2: DPR10.2 R106.1
NetDPR11_2: DPR11.2 U13.23(VBUS_DS)
NetJ11_4: R116.2 U13.27(SWDCLK) ; port SWD_CLK
NetJ31_2: J31.2 R123.2
NetJ32_2: J32.2 R124.2
NetR106_2: R106.2 R107.1 U13.22(VBUS_US)
NetR115_2: R115.2 U19.1(A0)
NetR117_1: R117.1 SUSP10.2(CATHODE)

### Notes on the sheet
- CYUSB3314-88LTXC-DEVICE CONNECTION
- 1-2: US VBUS Detect
- 2-3: HX3 as Embedded Hub
- (near DPR11) DS VBUS Enable input for proprietary Wall
  Charger Emulation
- UP STREAM
- VBUS_DS=0 - Disable multi-charger mode
- VBUS_DS=1 - Enable Multi-charger mode
- (near J25) DS1
- (near C171) I2C HEADER
- (near J28) DS2
- EEPROM
- (near J29) DS3
- WP=1 : Write Protect Enable
- WP=0 : Write Protect Disable
- Note: EEPROM is permanently Write
  Protect disabled on DVK.
- 26MHz
- (near J30) DS4
- J7
- 1
- J6
- HX3 Configuration Modes
- Default configuration
- 0
- I2C Slave, configure from
  external I2C Master
- I2C Master, read from I2C
  EEPROM
- (near *#2) CYPRESS SEMICONDUCTOR  ?2014
- Note:
  Connect the HX3 EPAD to GND through the via stitches.
- (in symbol CAP POL) +
- (in symbol CYUSB3314-88LTXC_2, part A) UP STREAM; I2C; RREF.PWR & OVRCUR; DOWN STREAM; CLOCK & RESET; MODE SEL
- (in symbol TitleBlock0) Title; Size; Document Number; Rev; Date:; Sheet; of
- (in symbol UEA1112C-4HK1-4H) USB 3.0 / A REC THRU
- (in symbol UEA1112C_TX) USB 3.0 / A REC THRU
- (in symbol UEB1112C-2AK1-4H) USB 3.0 / B REC THRU

### Library data of the parts
C164 C166-C169 C175 C176 C179 C181 C182 C185 C186 C189 C190 = CAPACITOR NON-POL
  C164 C175 C176 C189 C190: Manufacturer: *; Part Number: *
  C181: Manufacturer: *
C165 C174 C180 C187 = CAP POL: CAP ALUM 150UF 16V 20% SMD; Part Number: EEE-FK1C151XP; Manufacturer: Panasonic Electronic Components; Lead Free: YES
C170 C173 C178 C184 C192 = CAPACITOR NON-POL: Part Number: C1005X7R1V103M050BB; Manufacturer: *
C171 C172 C177 C183 C191 = CAPACITOR NON-POL: Part Number: C1005X7R1V104K050BB
  C172 C177 C183 C191: Manufacturer: *
C188 = CAPACITOR NON-POL: CAP CER 1.5UF 10V 10% X7R 0805; Manufacturer: TDK Corporation; Lead Free: YES
DPR10 DPR11 = DPR12_0: Resistor, 4.7K, 0402, 1/10W, 5%; Part Number: ERJ-2GEJ472X
J24 = HEADER_1x2: Manufacturer: Samtec Inc; Part Number: TSW-102-08-G-S; Lead Free: YES
J25 J28 J30 = UEA1112C_TX: 9 Position Right Angle 3.0 USB Connector; Manufacturer: FOXCONN; Part Number: UEA1112C-4HK1-4H; Lead Free: YES
J26 = UEB1112C-2AK1-4H: USB 3.0 B Series Right Angle,T/H 9 Pos; Lead Free: YES; Part Number: UEB1112C-2AK1-4H
J27 = HEADER 4: CONN HEADER 4POS .100" SNGL GOLD; Manufacturer: Samtec Inc; Part Number: TSW-104-08-G-S; Lead Free: YES
J29 = UEA1112C-4HK1-4H: 9 Position Right Angle 3.0 USB Connector; Manufacturer: FOXCONN; Part Number: UEA1112C-4HK1-4H
J31 J32 = 3PIN JUM: CONN HEADER VERT 3POS .100 TIN; Part Number: 3-644456-3; Manufacturer: Tyco Electronics; Type: Single Row,3Pin Header
L17 L19-L21 = INDUCTOR: FERRITE CHIP 220 OHM 2A 0805; Manufacturer: Murata; DEVICE: L3; Part Number: BLM21PG221SN1D; Lead Free: YES
L18 = INDUCTOR: FERRITE CHIP 220 OHM 2A 0805; Manufacturer: Murata; Lead Free: YES; Part Number: BLM21PG221SN1D
R106 = R_Dup1: Manufacturer: Panasonic; Part Number: ERJ-2GE0R00X
R107 = R_Dup1: Part Number: ERJ-2RKF4990X; Manufacturer: Panasonic
R108 = R: RES 1M OHM 1/10W 1% 0603 SMD; Part Number: ERJ-3EKF1004V; Manufacturer: Panasonic
R109 = R: RES 1M OHM 1/10W 1% 0603 SMD; Manufaturer: Panasonic; Part Number: ERJ-3EKF1004V
R110 = R_Dup1: RES 2.00K OHM 1/10W 1% 0603 SMD; Manufacturer: Rohm Semiconductor; Part Number: MCR03EZPFX2001; Lead Free: YES
R111 = R_Dup1: RES 2.00K OHM 1/10W 1% 0603 SMD; Part Number: MCR03EZPFX2001; Manufacturer: Rohm Semiconductor; Lead Free: YES
R112 = R_Dup1: RES 200 OHM 1% 0603 SMD; Manufacturer: Stackpole; Part Number: RNCP0603FTD200R
R113 = R_Dup1: RES 6.04K OHM .25W 1% 0603 SMD; Part Number: CRCW06036K04FKEAHP; Manufacturer: Vishay Dale
R114 = R: RES 1M OHM 1/10W 1% 0603 SMD; Manufacturer: Panasonic; PART_NUMBER: ERJ-3EKF1004V
R115 R118 = R_Dup1: RES 10.0K OHM 1/10W 1% 0603 SMD; Part Number: ERJ-3EKF1002V; Manufacturer: Panasonic - ECG; Lead Free: YES
R116 = R_Dup1: RES 10.0K OHM 1/10W 1% 0603 SMD; Manufacturer: Panasonic - ECG; Part Number: ERJ-3EKF1002V; Lead Free: YES
R117 = R_Dup1: Lead Free: YES
R119 R122 = R: RES 1M OHM 1/10W 1% 0603 SMD; Manufacturer: Panasonic; Part Number: ERJ-3EKF1004V
R120 R123 R124 = R_Dup1: Manufacturer: Panasonic; Part Number: ERJ-2RKF49.9X
R121 = R_Dup1: Part Number: ERJ-2RKF49.9X; Manufacturer: Panasonic
SUSP10 = LED: Part Number: VLMO1300-GS08
SW10 = B3U1000P: Part Number: EVQ-5PN04K
TP17 TP19 = TP: TEST POINT PC MINI .040"D RED; Part Number: 5000; Manufacturer: Keystone
TP18 TP20 = TP: TEST POINT PC MINI .040"D RED; PART_NUMBER: 5000; Manufacturer: Keystone
U13 = CYUSB3314-88LTXC_2: Part Number: CYUSB3314-88LTXC
U19 = 24LC128: IC EEPROM 128KBIT 400KHZ 8SOIC; Manufacturer: Microchip Technology; Lead Free: YES; Part Number: 24LC128-I/SM
Y10 = CRYSTAL_1: Manufacturer: NDK; Part Number: NX3225SA-26.000000MHZ-G4
*#2 = TitleBlock0: Page Create Date: March  8, 1995
U16-U18 U?#1-U?#12 = TPD2EUSB30ADRTR: Part Number: TPD2EUSB30ADRTR

## Sheet Cyusb3314_Indicator.SchDoc
size 391 x 287 mm
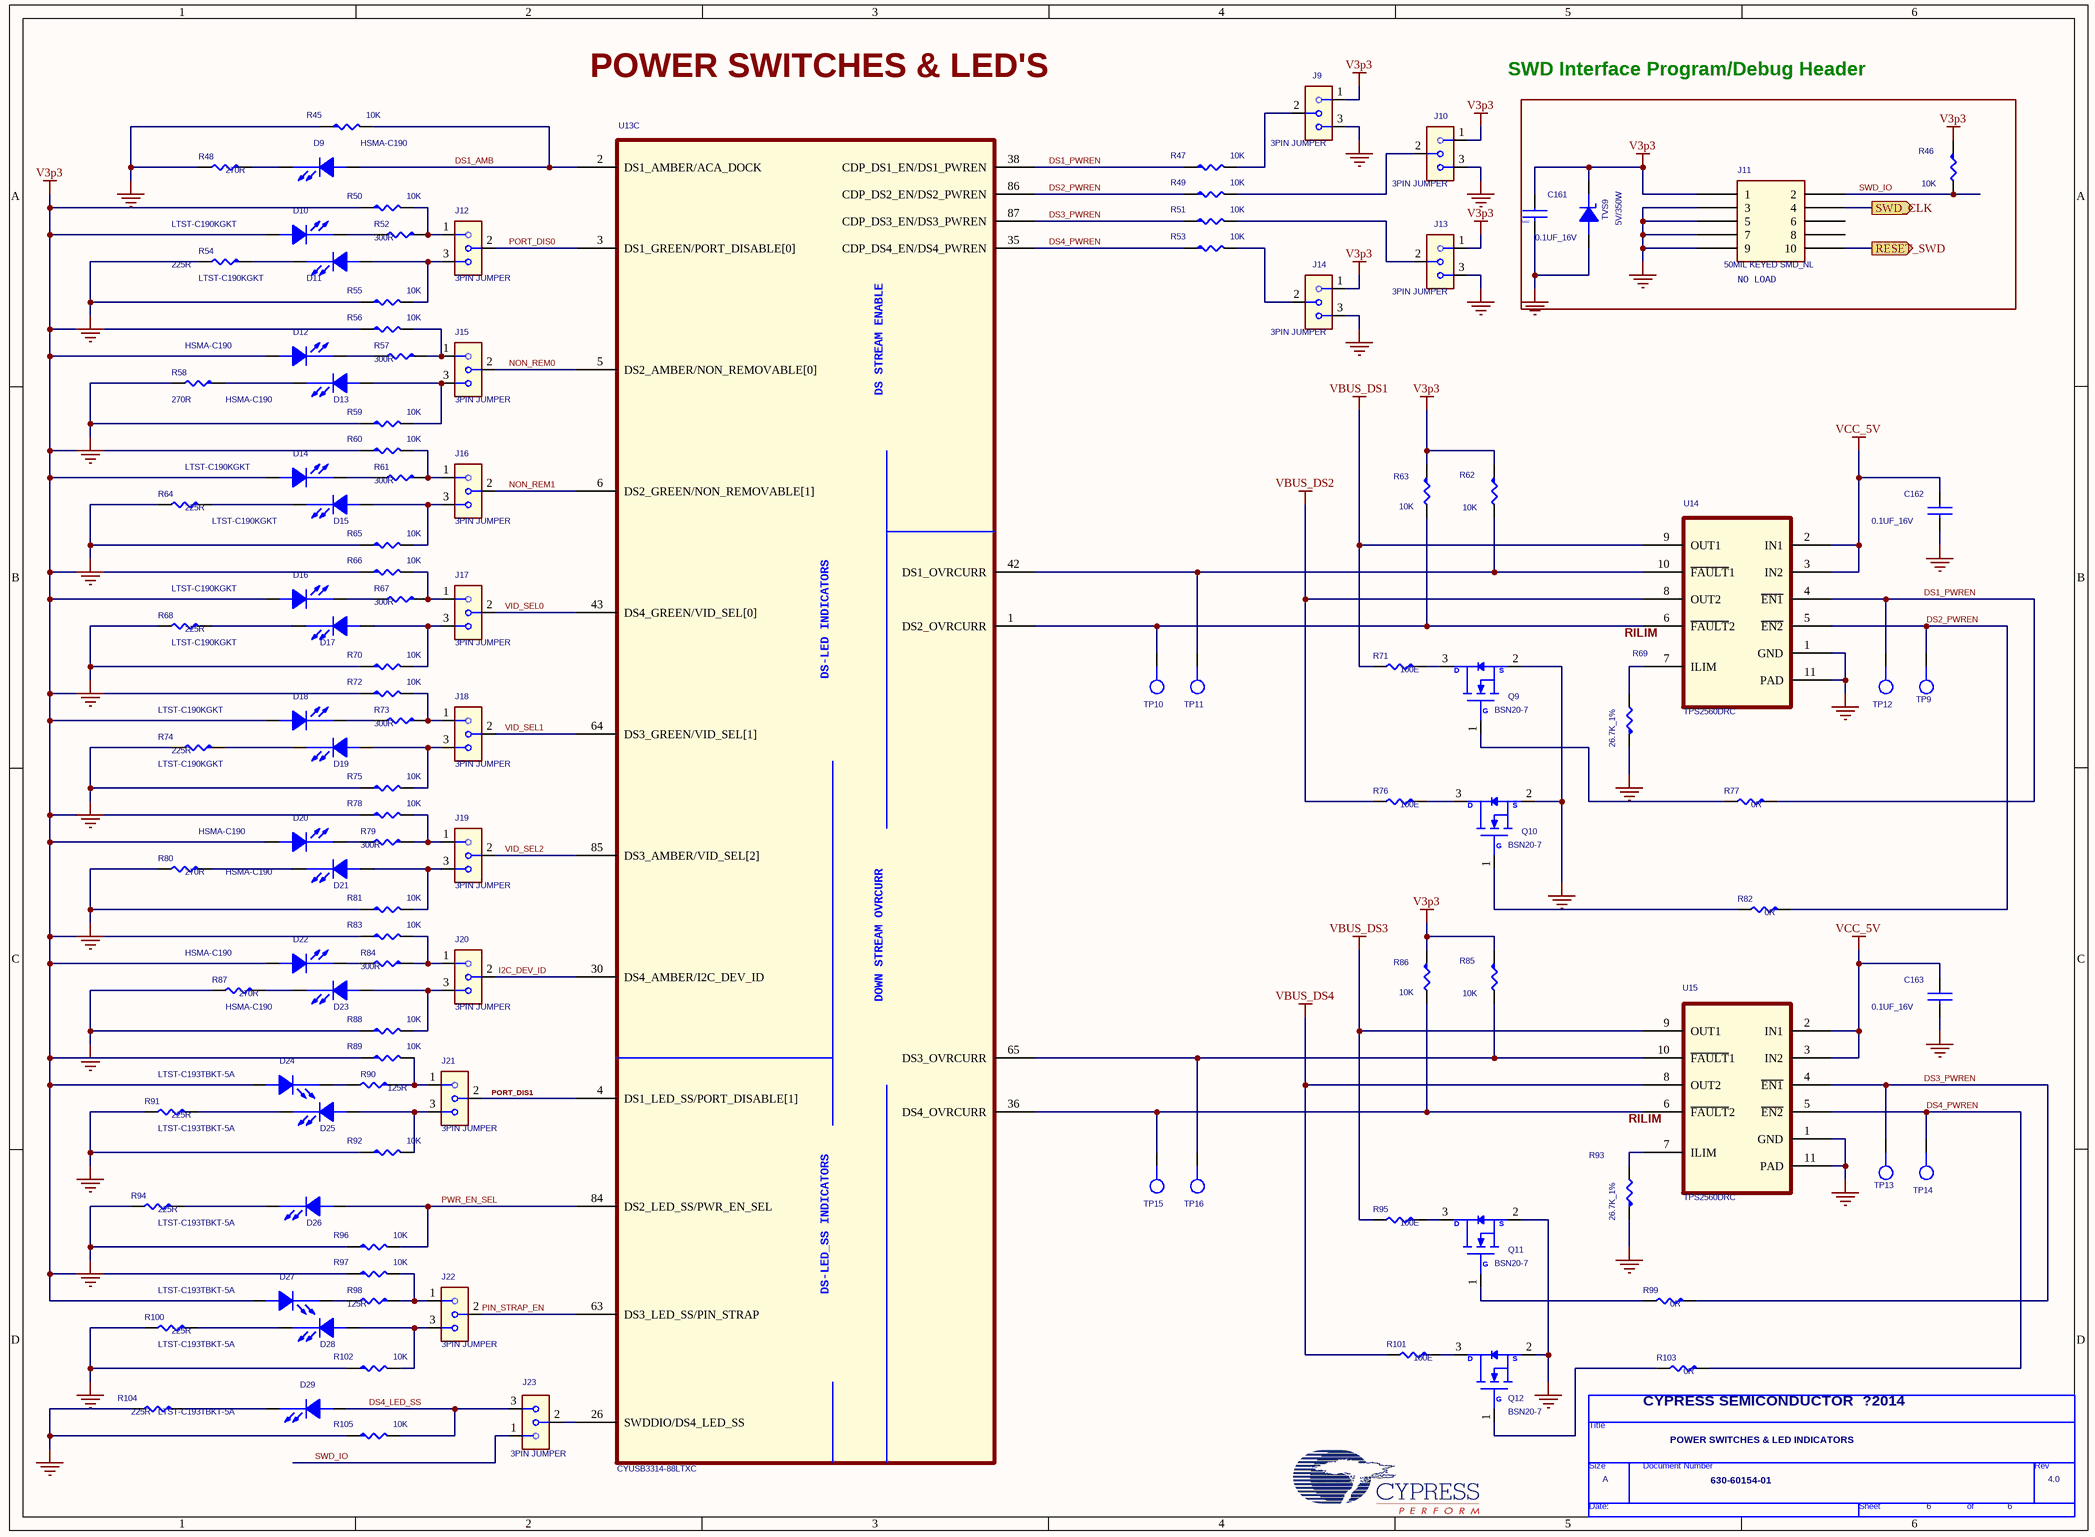
[diagram p8: Cyusb3314_Indicator.SchDoc]

### Parts
(Parts that share a designator on the sheet are numbered #1, #2 ... from top to bottom, then left to right.)
*#3  Page Count: 6  Page Size: A  Title: POWER SWITCHES & LED INDICATORS  RevCode: 4.0  Doc: 630-60154-01  (hidden comment: TitleBlock0)  (graphical)
C161  0.1UF_16V  [CAPC1005X55M]
C162  0.1UF_16V  [CAPC1005X56M]
C163  0.1UF_16V  [CAPC1005X56M]
D9  HSMA-C190  [LEDC1608X80M]
D10  LTST-C190KGKT  [LEDC1608X80M]
D11  LTST-C190KGKT  [LEDC1608X80M]
D12  HSMA-C190  [LEDC1608X80M]
D13  HSMA-C190  [LEDC1608X80M]
D14  LTST-C190KGKT  [LEDC1608X80M]
D15  LTST-C190KGKT  [LEDC1608X80M]
D16  LTST-C190KGKT  [LEDC1608X80M]
D17  LTST-C190KGKT  [LEDC1608X80M]
D18  LTST-C190KGKT  [LEDC1608X80M]
D19  LTST-C190KGKT  [LEDC1608X80M]
D20  HSMA-C190  [LEDC1608X80M]
D21  HSMA-C190  [LEDC1608X80M]
D22  HSMA-C190  [LEDC1608X80M]
D23  HSMA-C190  [LEDC1608X80M]
D24  LTST-C193TBKT-5A  [LEDC1608X35M]
D25  LTST-C193TBKT-5A  [LEDC1608X35M]
D26  LTST-C193TBKT-5A  [LEDC1608X35M]
D27  LTST-C193TBKT-5A  [LEDC1608X35M]
D28  LTST-C193TBKT-5A  [LEDC1608X35M]
D29  LTST-C193TBKT-5A  [LEDC1608X35M]
J9  3PIN JUMPER  [TE_3-644456-3]
J10  3PIN JUMPER  [TE_3-644456-3]
J11  50MIL KEYED SMD_NL  [SAMTEC_FTSH-105-01-L-DV-K]
J12  3PIN JUMPER  [TE_3-644456-3]
J13  3PIN JUMPER  [TE_3-644456-3]
J14  3PIN JUMPER  [TE_3-644456-3]
J15  3PIN JUMPER  [TE_3-644456-3]
J16  3PIN JUMPER  [TE_3-644456-3]
J17  3PIN JUMPER  [TE_3-644456-3]
J18  3PIN JUMPER  [TE_3-644456-3]
J19  3PIN JUMPER  [TE_3-644456-3]
J20  3PIN JUMPER  [TE_3-644456-3]
J21  3PIN JUMPER  [TE_3-644456-3]
J22  3PIN JUMPER  [TE_3-644456-3]
J23  3PIN JUMPER  [TE_3-644456-3]
Q9  BSN20-7  [SOT92P240X110-3M]
Q10  BSN20-7  [SOT92P240X110-3M]
Q11  BSN20-7  [SOT92P240X110-3M]
Q12  BSN20-7  [SOT92P240X110-3M]
R45  10K  [RESC1005X40M]
R46  10K  [RESC1005X40M]
R47  10K  [RESC1005X40M]
R48  270R  [RESC1608X50M]
R49  10K  [RESC1005X40M]
R50  10K  [RESC1005X40M]
R51  10K  [RESC1005X40M]
R52  300R  [RESC2012X65M]
R53  10K  [RESC1005X40M]
R54  225R  [RESC1608X50M]
R55  10K  [RESC1005X40M]
R56  10K  [RESC1005X40M]
R57  300R  [RESC2012X65M]
R58  270R  [RESC1608X50M]
R59  10K  [RESC1005X40M]
R60  10K  [RESC1005X40M]
R61  300R  [RESC2012X65M]
R62  10K  [RESC1005X40M]
R63  10K  [RESC1005X40M]
R64  225R  [RESC1608X50M]
R65  10K  [RESC1005X40M]
R66  10K  [RESC1005X40M]
R67  300R  [RESC2012X65M]
R68  225R  [RESC1608X50M]
R69  26.7K_1%  [RESC1005X40M]
R70  10K  [RESC1005X40M]
R71  100E  [RESC1608X50M]
R72  10K  [RESC1005X40M]
R73  300R  [RESC2012X65M]
R74  225R  [RESC1608X50M]
R75  10K  [RESC1005X40M]
R76  100E  [RESC1608X50M]
R77  0R  [RESC1608X50M]
R78  10K  [RESC1005X40M]
R79  300R  [RESC2012X65M]
R80  270R  [RESC1608X50M]
R81  10K  [RESC1005X40M]
R82  0R  [RESC1608X50M]
R83  10K  [RESC1005X40M]
R84  300R  [RESC2012X65M]
R85  10K  [RESC1005X40M]
R86  10K  [RESC1005X40M]
R87  270R  [RESC1608X50M]
R88  10K  [RESC1005X40M]
R89  10K  [RESC1005X40M]
R90  125R  [RESC2012X65M]
R91  225R  [RESC1608X50M]
R92  10K  [RESC1005X40M]
R93  26.7K_1%  [RESC1005X40M]
R94  225R  [RESC1608X50M]
R95  100E  [RESC1608X50M]
R96  10K  [RESC1005X40M]
R97  10K  [RESC1005X40M]
R98  125R  [RESC2012X65M]
R99  0R  [RESC1608X50M]
R100  225R  [RESC1608X50M]
R101  100E  [RESC1608X50M]
R102  10K  [RESC1005X40M]
R103  0R  [RESC1608X50M]
R104  225R  [RESC1608X50M]
R105  10K  [RESC1005X40M]
TP9  TP_YEL  [KEYSTONE_5000]  (value not drawn)
TP10  TEST POINT  [TP25C50]  (value not drawn)
TP11  TP_YEL  [KEYSTONE_5000]  (value not drawn)
TP12  TEST POINT  [TP25C50]  (value not drawn)
TP13  TP_YEL  [KEYSTONE_5000]  (value not drawn)
TP14  TEST POINT  [TP25C50]  (value not drawn)
TP15  TEST POINT  [TP25C50]  (value not drawn)
TP16  TP_YEL  [KEYSTONE_5000]  (value not drawn)
TVS9  5V/350W  [SOD2513X120M]
U13  CYUSB3314-88LTXC  [QFN40P1000X1000X100-89M]  (part C of 3)
U14  TPS2560DRC  [SON50P300X300X100-11M]
U15  TPS2560DRC  [SON50P300X300X100-11M]

### Blocks framed on the sheet
NO LOAD: C161 J11 R46 TVS9

### Ports
RESET_SWD (out), SWD_CLK (out)

### Nets
GND: C161.2 C162.2 C163.2 J9.3 J10.3 J11.3 J11.5 J11.7 J11.9 J13.3 J14.3 Q9.2(S) Q10.2(S) Q11.2(S) Q12.2(S) R45.1 R48.2 R54.2 R55.1 R58.2 R59.1 R64.2 R65.1 R68.2 R69.1 R70.1 R74.2 R75.1 R80.2 R81.1 R87.2 R88.1 R91.2 R92.1 R93.1 R94.2 R96.1 R100.2 R102.1 R104.2 R105.1 TVS9.2(A) U14.1(GND) U14.11(PAD) U15.1(GND) U15.11(PAD)
V3p3: C161.1 D10.1(ANODE) D12.1(ANODE) D14.1(ANODE) D16.1(ANODE) D18.1(ANODE) D20.1(ANODE) D22.1(ANODE) D24.1(ANODE) D27.1(ANODE) J9.1 J10.1 J11.1 J13.1 J14.1 R46.1 R50.1 R56.1 R60.1 R62.1 R63.1 R66.1 R72.1 R78.1 R83.1 R85.1 R86.1 R89.1 R97.1 TVS9.1(K)  [project net VCC(+3.3V)]
VBUS_DS1: R71.2 U14.9(OUT1)
VBUS_DS2: R76.2 U14.8(OUT2)
VBUS_DS3: R95.2 U15.9(OUT1)
VBUS_DS4: R101.2 U15.8(OUT2)
VCC_5V: C162.1 C163.1 U14.2(IN1) U14.3(IN2) U15.2(IN1) U15.3(IN2)  [project net VCC(+5V)]
DS1_AMB: D9.1(ANODE) R45.2 U13.2(DS1_AMBER/ACA_DOCK)
DS1_PWREN: R47.1 R77.1 TP12.1(TP) U13.38(CDP_DS1_EN/DS1_PWREN) U14.4(~{EN1})
DS2_PWREN: R49.1 R82.1 TP9.1(TP) U13.86(CDP_DS2_EN/DS2_PWREN) U14.5(~{EN2})
DS3_PWREN: R51.1 R99.1 TP13.1(TP) U13.87(CDP_DS3_EN/DS3_PWREN) U15.4(~{EN1})
DS4_LED_SS: D29.1(ANODE) J23.3 R105.2
DS4_PWREN: R53.1 R103.1 TP14.1(TP) U13.35(CDP_DS4_EN/DS4_PWREN) U15.5(~{EN2})
I2C_DEV_ID: J20.2 U13.30(DS4_AMBER/I2C_DEV_ID)
NON_REM0: J15.2 U13.5(DS2_AMBER/NON_REMOVABLE[0])
NON_REM1: J16.2 U13.6(DS2_GREEN/NON_REMOVABLE[1])
PIN_STRAP_EN: J22.2 U13.63(DS3_LED_SS/PIN_STRAP)
PORT_DIS0: J12.2 U13.3(DS1_GREEN/PORT_DISABLE[0])
PORT_DIS1: J21.2 U13.4(DS1_LED_SS/PORT_DISABLE[1])
PWR_EN_SEL: D26.1(ANODE) R96.2 U13.84(DS2_LED_SS/PWR_EN_SEL)
SWD_IO: J11.2 J23.1 R46.2
VID_SEL0: J17.2 U13.43(DS4_GREEN/VID_SEL[0])
VID_SEL1: J18.2 U13.64(DS3_GREEN/VID_SEL[1])
VID_SEL2: J19.2 U13.85(DS3_AMBER/VID_SEL[2])
NetC188_1: J11.10 ; port RESET_SWD
NetD9_2: D9.2(CATHODE) R48.1
NetD10_2: D10.2(CATHODE) R52.2
NetD11_1: D11.1(ANODE) J12.3 R55.2
NetD11_2: D11.2(CATHODE) R54.1
NetD12_2: D12.2(CATHODE) R57.2
NetD13_1: D13.1(ANODE) J15.3 R59.2
NetD13_2: D13.2(CATHODE) R58.1
NetD14_2: D14.2(CATHODE) R61.2
NetD15_1: D15.1(ANODE) J16.3 R65.2
NetD15_2: D15.2(CATHODE) R64.1
NetD16_2: D16.2(CATHODE) R67.2
NetD17_1: D17.1(ANODE) J17.3 R70.2
NetD17_2: D17.2(CATHODE) R68.1
NetD18_2: D18.2(CATHODE) R73.2
NetD19_1: D19.1(ANODE) J18.3 R75.2
NetD19_2: D19.2(CATHODE) R74.1
NetD20_2: D20.2(CATHODE) R79.2
NetD21_1: D21.1(ANODE) J19.3 R81.2
NetD21_2: D21.2(CATHODE) R80.1
NetD22_2: D22.2(CATHODE) R84.2
NetD23_1: D23.1(ANODE) J20.3 R88.2
NetD23_2: D23.2(CATHODE) R87.1
NetD24_2: D24.2(CATHODE) R90.2
NetD25_1: D25.1(ANODE) J21.3 R92.2
NetD25_2: D25.2(CATHODE) R91.1
NetD26_2: D26.2(CATHODE) R94.1
NetD27_2: D27.2(CATHODE) R98.2
NetD28_1: D28.1(ANODE) J22.3 R102.2
NetD28_2: D28.2(CATHODE) R100.1
NetD29_2: D29.2(CATHODE) R104.1
NetJ9_2: J9.2 R47.2
NetJ10_2: J10.2 R49.2
NetJ11_4: J11.4 ; port SWD_CLK
NetJ12_1: J12.1 R50.2 R52.1
NetJ13_2: J13.2 R51.2
NetJ14_2: J14.2 R53.2
NetJ15_1: J15.1 R56.2 R57.1
NetJ16_1: J16.1 R60.2 R61.1
NetJ17_1: J17.1 R66.2 R67.1
NetJ18_1: J18.1 R72.2 R73.1
NetJ19_1: J19.1 R78.2 R79.1
NetJ20_1: J20.1 R83.2 R84.1
NetJ21_1: J21.1 R89.2 R90.1
NetJ22_1: J22.1 R97.2 R98.1
NetJ23_2: J23.2 U13.26(SWDDIO/DS4_LED_SS)
NetQ9_1: Q9.1(G) R77.2
NetQ9_3: Q9.3(D) R71.1
NetQ10_1: Q10.1(G) R82.2
NetQ10_3: Q10.3(D) R76.1
NetQ11_1: Q11.1(G) R99.2
NetQ11_3: Q11.3(D) R95.1
NetQ12_1: Q12.1(G) R103.2
NetQ12_3: Q12.3(D) R101.1
NetR62_2: R62.2 TP11.1(TP) U13.42(DS1_OVRCURR) U14.10(~{FAULT}1)
NetR63_2: R63.2 TP10.1(TP) U13.1(DS2_OVRCURR) U14.6(~{FAULT}2)
NetR69_2: R69.2 U14.7(ILIM)
NetR85_2: R85.2 TP16.1(TP) U13.65(DS3_OVRCURR) U15.10(~{FAULT}1)
NetR86_2: R86.2 TP15.1(TP) U13.36(DS4_OVRCURR) U15.6(~{FAULT}2)
NetR93_2: R93.2 U15.7(ILIM)

Not connected (* = marked no-connect by the designer): J11 6 8

### Notes on the sheet
- POWER SWITCHES & LED'S
- SWD Interface Program/Debug Header
- (near U14) RILIM
- (near U15) RILIM
- (near R103) CYPRESS SEMICONDUCTOR  ?2014
- (in symbol 0.1 uFd 0402) 0402
- (in symbol CYUSB3314-88LTXC_2, part C) DS STREAM ENABLE; DS-LED INDICATORS; DOWN STREAM OVRCURR; DS-LED_SS INDICATORS
- (in symbol TitleBlock0) Title; Size; Document Number; Rev; Date:; Sheet; of

### Library data of the parts
C161 = 0.1 uFd 0402: CAP .1UF 16V CERAMIC Y5V 0402; Cy_part#: 730R-10010; Manufacturer: Panasonic - ECG; Part Number: ECJ-0EF1C104Z; DEVICE: 0p1uFd_0402; CLASS: DISCRETE; ALT_SYMBOLS: C-CC0402_A; VOLTAGE: 16V; Created by: SNF
C162 C163 = CAPACITOR NON-POL: Manufacturer: *; Part Number: *
D9-D29 = LED: Manufacturer: *
  D9 D12 D13 D20-D23: Part Number: HSMA-C190
  D10 D11 D14-D19: Part Number: LTST-C190KGKT
  D24-D29: Part Number: LTST-C193TBKT-5A
J9 J12 J13 J15 J16 J18 J21-J23 = 3PIN JUM: as J31 on sheet Cyusb3314_Interface; Type: Single Row,3Pin Header
J10 J14 J17 J19 J20 = 3PIN JUM: CONN HEADER VERT 3POS .100 TIN; Manufacturer: Tyco Electronics; Part Number: 3-644456-3; Type: Single Row,3Pin Header
J11 = 10 Pin Header 50mil Keyed SMD: CONN HEADER 10 PIN 50MIL KEYED SMD; Part Number: FTSH-105-01-L-DV-K; Manufacturer: Samtec; Cy_part#: 420R-14312; CLASS: IO; Last Edit By: SNF; DEVICE: HDR5x2x50KS
Q9-Q12 = BSN20-7: MOSFET N-CH 50V 500MA SOT23; Manufacturer: Diodes Inc; PSpiceTemplate: X^@REFDES %D %G %S @MODEL; Part Number: BSN20-7
R45-R47 R49-R51 R53 R55 R60 R62 R65 R70 R72 R75 R78 R81 R86 R88 R89 R96 R97 R102 R105 = R_Dup1: as R116 on sheet Cyusb3314_Interface; Lead Free: YES
R48 R52 R54 R57 R58 R61 R64 R67 R68 R71 R73 R74 R76 R77 R79 R80 R82 R84 R87 R90 R91 R94 R95 R98-R101 R103 R104 = R_Dup1: Lead Free: YES
  R48 R58: Value: 270R
  R54: Value: 225R
R56 R59 R63 R66 R83 R85 R92 = R_Dup1: as R115 on sheet Cyusb3314_Interface; Lead Free: YES
R69 = R_Dup1: RES 28.0K OHM 1/10W 1% 0402 SMD; Manufacturer: Panasonic; Part Number: ERJ-2RKF2802X; Manufacturer Part Num: R5110402; Tolerance: 1%
R93 = R_Dup1: RES 28.0K OHM 1/10W 1% 0402 SMD; Part Number: ERJ-2RKF2802X; Manufacturer Part Num: R5110402; Manufacturer: Panasonic; Tolerance: 1%
TP9 TP13 = TP: TEST POINT PC MINI .040"D RED; Manufacturer: Keystone; Part Number: 5000
TP10 TP12 TP14 TP15 = TP
TP11 TP16 = TP: as TP17 on sheet Cyusb3314_Interface
TVS9 = TVS 5V SOD-323_0: TVS UNIDIR 350W 5V SOD-323; Part Number: SD05.TCT; Manufacturer: Dioded Inc.; CLASS: DISCRETE; DEVICE: SD05-7; LastEditBy: gir
U13 = CYUSB3314-88LTXC_2: Manufacturer: *; Part Number: CYUSB3314-88LTXC
*#3 = TitleBlock0: Page Number: 6; Page Create Date: March  8, 1995
U14 U15 = TPS2560DRC: Part Number: TPS2560DRC; Manufacturer: *

## Sheet Power.SchDoc
size A4
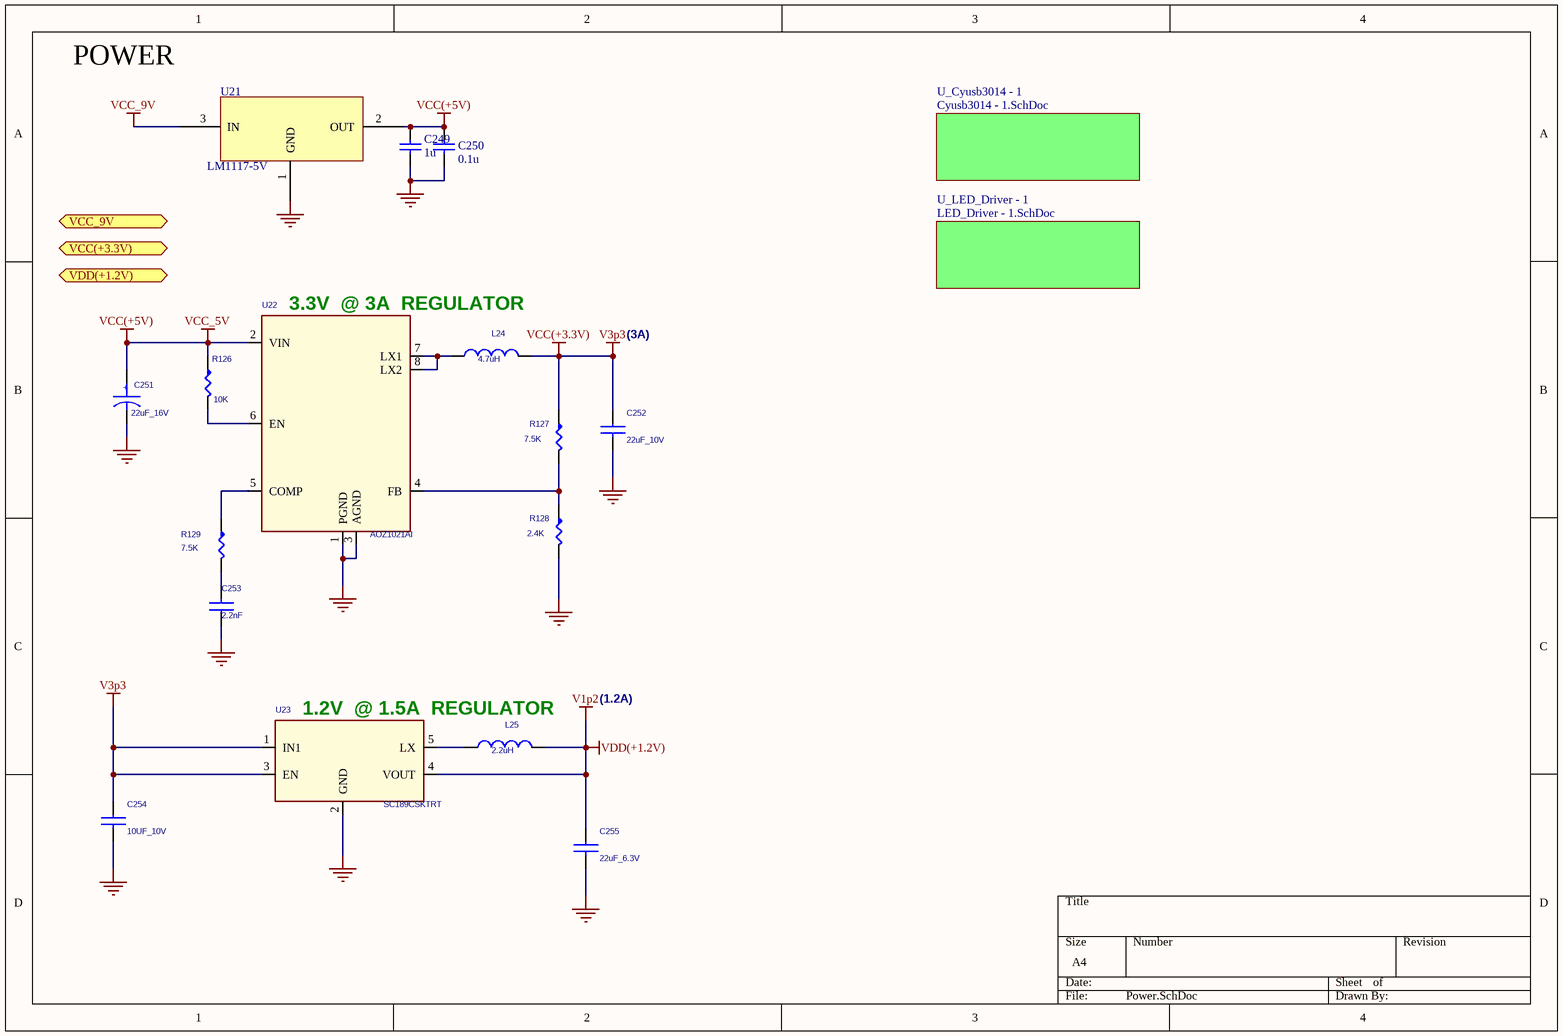
[diagram p9: Power.SchDoc]

### Parts
C249  1u  [C0603]
C250  0.1u  [C0603]
C251  22uF_16V  [CAPCP3216X100M]
C252  22uF_10V  [CAPC3216X100M]
C253  2.2nF  [CAPC2112X70M]
C254  10UF_10V  [CAPC2012X145M]
C255  22uF_6.3V  [CAPC3216X100M]
L24  4.7uH  [IND_NR6028T4R7M]
L25  2.2uH  [INDP3225X240M]
R126  10K  [RESC1608X55M]
R127  7.5K  [RESC1608X55M]
R128  2.4K  [RESC1608X55M]
R129  7.5K  [RESC1608X55M]
U21  LM1117-5V  [SOT-223]
U22  AOZ1021AI  [SOIC127P600X175-8M]
U23  SC189CSKTRT  [SOT95P280X145-5M]

### Sub-sheets
U_Cyusb3014 - 1 = Cyusb3014 - 1.SchDoc: no entries
U_LED_Driver - 1 = LED_Driver - 1.SchDoc: no entries

### Ports
VCC(+3.3V) (out), VCC_9V (in), VDD(+1.2V) (out)

### Nets
GND: C249.1 C250.2 C251.2 C252.2 C253.1 C254.2 C255.2 R128.2 U21.1(GND) U22.1(PGND) U22.3(AGND) U23.2(GND)
V1p2: C255.1 L25.2 U23.4(VOUT)  [also labelled VDD(+1.2V)]
VCC(+3.3V): C252.1 C254.1 L24.2 R127.1 U23.1(IN1) U23.3(EN)  [also labelled V3p3]
VCC(+5V): C249.2 C250.1 C251.1 R126.1 U21.2(OUT) U22.2(VIN)  [also labelled VCC_5V]
VCC_9V: U21.3(IN)
NetC253_2: C253.2 R129.2
NetL24_1: L24.1 U22.7(LX1) U22.8(LX2)
NetL25_1: L25.1 U23.5(LX)
NetR126_2: R126.2 U22.6(EN)
NetR127_2: R127.2 R128.1 U22.4(FB)
NetR129_1: R129.1 U22.5(COMP)

### Notes on the sheet
- POWER
- 3.3V  @ 3A  REGULATOR
- (3A)
- 1.2V  @ 1.5A  REGULATOR
- (1.2A)
- (in symbol CAP POL) +

### Library data of the parts
C249 = Cap: 50V/8.2u/0805; Value: 100n; Published: 8-Jun-2000; LatestRevisionDate: 17-Jul-2002; LatestRevisionNote: Re-released for DXP Platform.; PackageReference: RAD-0.3; Publisher: Altium Limited
C250 = CAP0805: Capacitor; Value: 104; Published: 8-Jun-2000; Revision: July-2002: Re-released for DXP Platform.; Publisher: Altium Limited
C251 = CAP POL: CAP TANT 22UF 16V 10% 1206; Manufacturer: Nichicon; Part Number: F951C226KQAAQ2; RoHS Compliant: Yes; Lead Free Status: No
C252 C254 C255 = CAPACITOR NON-POL: Manufacturer: *; Part Number: *
C253 = CAPACITOR NON-POL: CAP CER 2200PF 50V 10% X7R 0805; Manufacturer: Yageo; Part Number: CC0805KRX7R9BB222; Num Pins: 2; RoHS Compliant: Yes; Lead Free: YES
L24 = INDUCTOR: INDUCTOR 4.7UH 2.7A 20% SMD; Part Number: NR6028T4R7M; Manufacturer: Taiyo Yuden; Lead Free: YES
L25 = INDUCTOR: INDUCTOR 2.2UH 1.20A 20% 1210; Part Number: NLCV32T-2R2M-PFR; Manufacturer: TDK Corporation; Lead Free: YES
R126 = R_Dup1: as R116 on sheet Cyusb3314_Interface; Lead Free: YES
R127 = R_Dup1: RES 7.5K OHM 1/10W 1% 0603 SMD; Manufacturer: Panasonic - ECG; Part Number: ERJ-3EKF7501V; Lead Free: YES
R128 = R_Dup1: RES 2.4K OHM 1/10W 1% 0603 SMD; Manufacturer: Panasonic - ECG; Part Number: ERJ-3EKF2401V; Lead Free: YES
R129 = R_Dup1: RES 7.5K OHM 1/10W 1% 0603 SMD; Part Number: ERJ-3EKF7501V; Manufacturer: Panasonic - ECG; Lead Free: YES
U21 = AMS1117
U22 = AOZ1021AI: IC REG BUCK SYNC ADJ 3A 8SOIC; Manufacturer: Alpha & Omega Semiconductor Inc; Part Number: AOZ1021AI
U23 = SC189CSKTRT: IC REG BUCK SYNC 1.2V SOT23-5; Manufacturer: Semtech; Part Number: SC189CSKTRT

## Sheet Cyusb3014 - 1.SchDoc
size A3
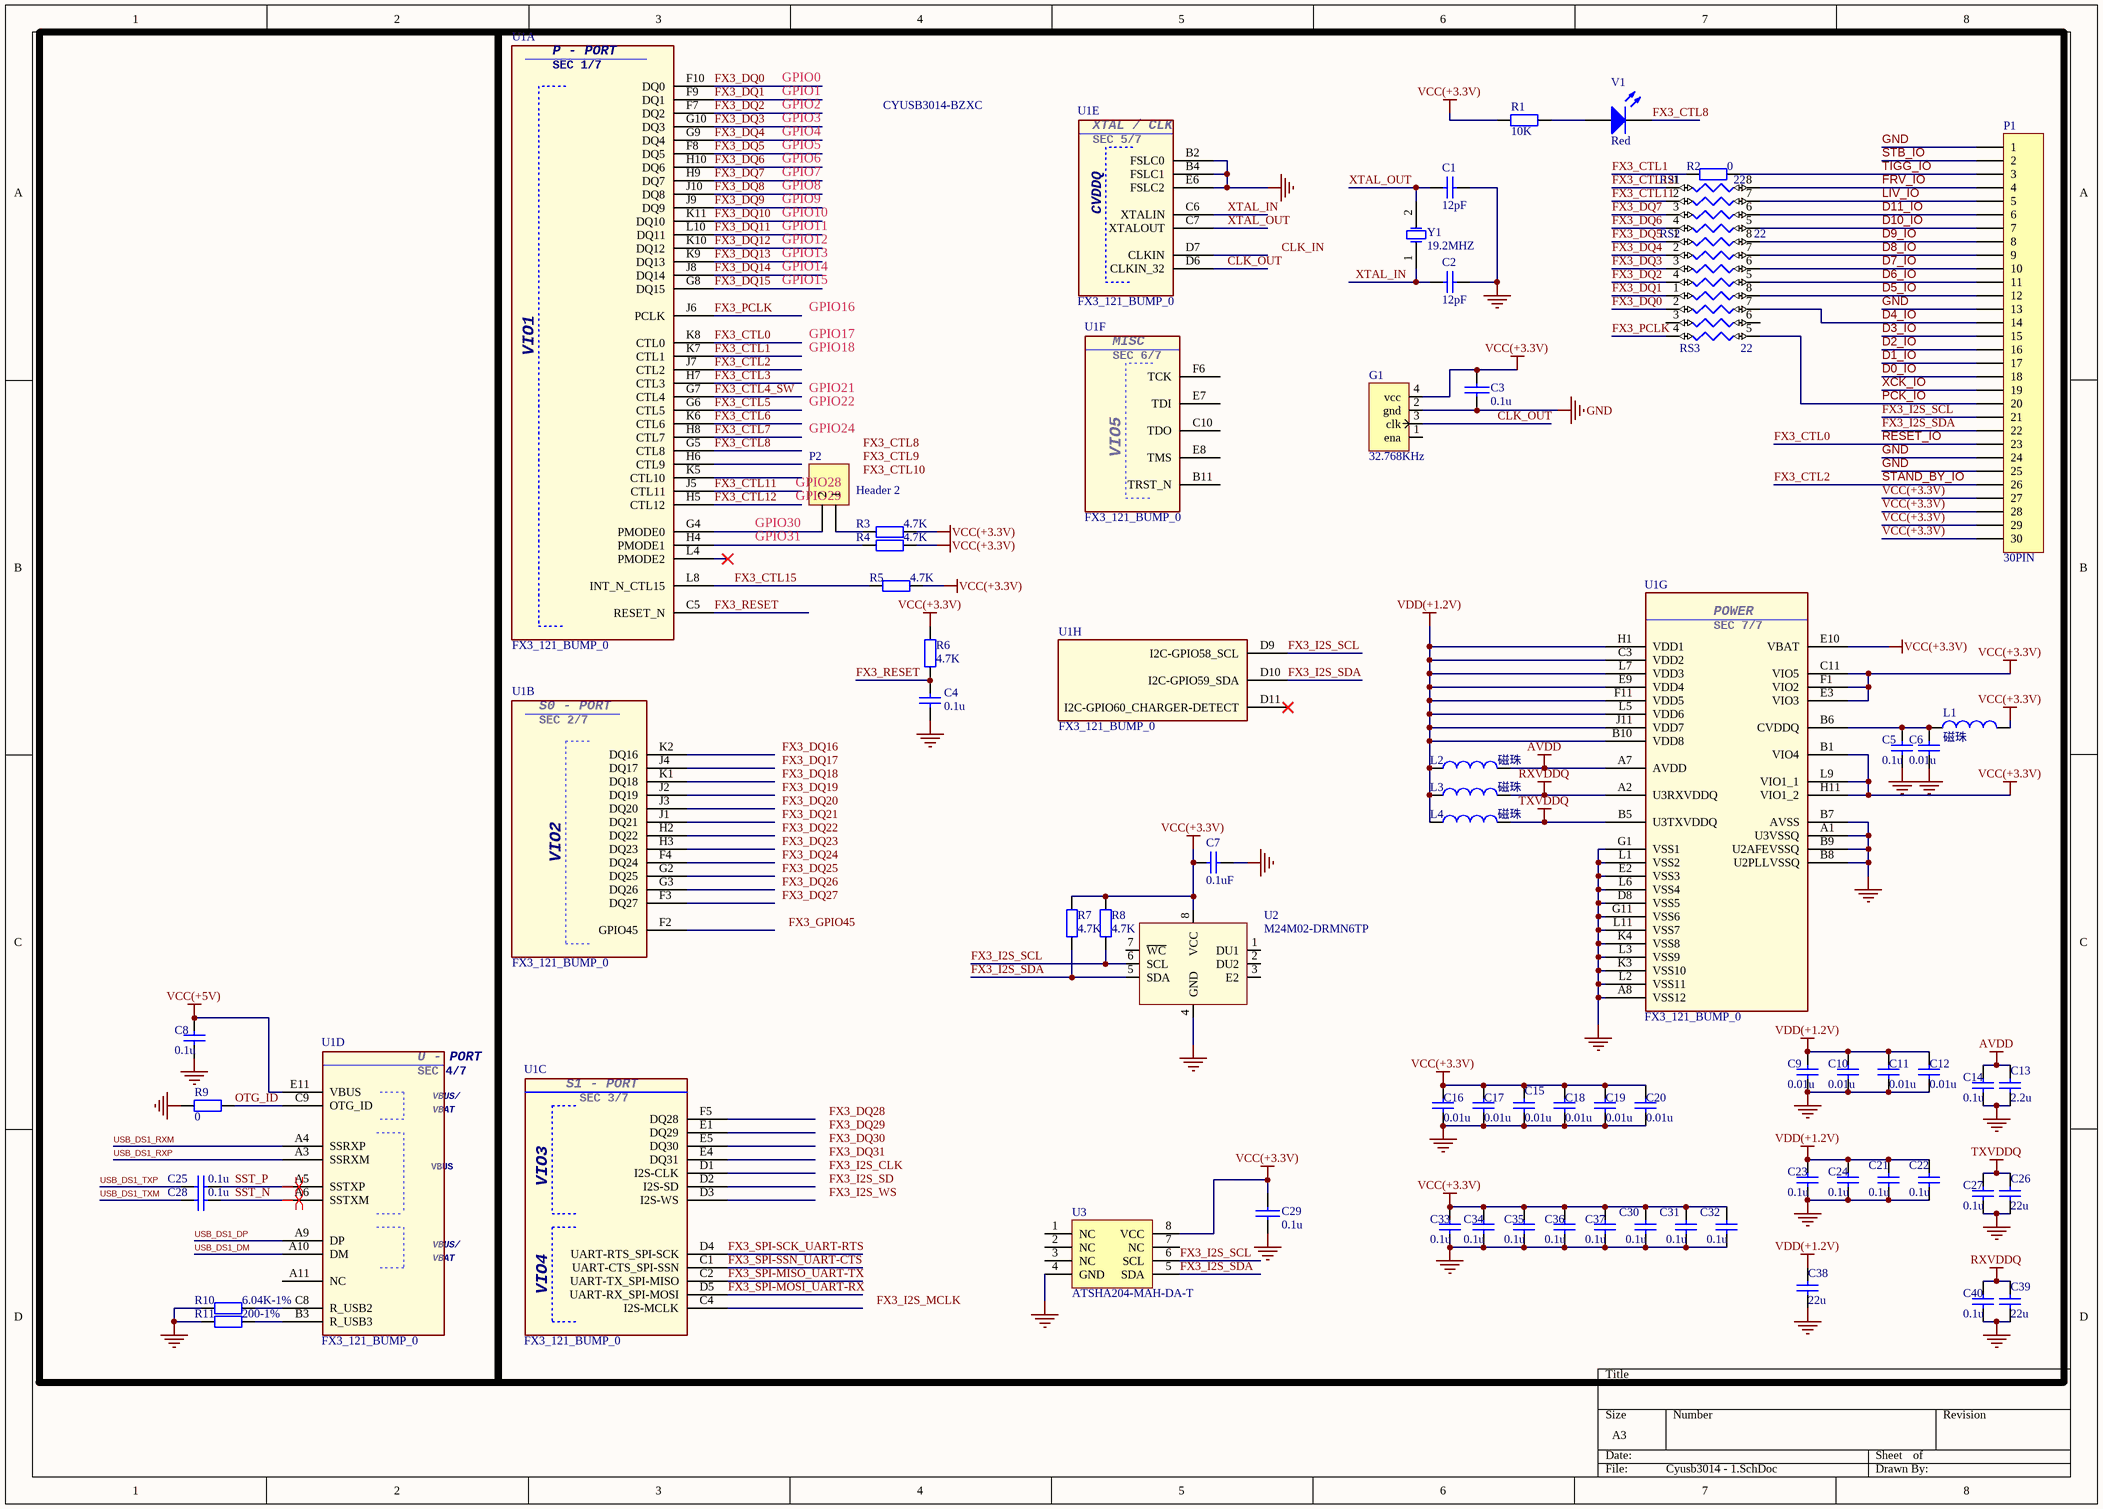
[diagram p10: Cyusb3014 - 1.SchDoc]

### Parts
C1  12pF  [0603S-CAP]
C2  12pF  [0603S-CAP]
C3  0.1u  [0603S-CAP]
C4  0.1u  [0603S-CAP]
C5  0.1u  [C0402]
C6  0.01u  [C0402]
C7  0.1uF  [0603S-CAP]
C8  0.1u  [C0402]
C9  0.01u  [C0402]
C10  0.01u  [C0402]
C11  0.01u  [C0402]
C12  0.01u  [C0402]
C13  2.2u  [C0805S-CAP]
C14  0.1u  [C0402]
C15  0.01u  [C0402]
C16  0.01u  [C0402]
C17  0.01u  [C0402]
C18  0.01u  [C0402]
C19  0.01u  [C0402]
C20  0.01u  [C0402]
C21  0.1u  [C0402]
C22  0.1u  [C0402]
C23  0.1u  [C0402]
C24  0.1u  [C0402]
C25  0.1u  [C0402]
C26  22u  [C0805S-CAP]
C27  0.1u  [C0402]
C28  0.1u  [C0402]
C29  0.1u  [0603S-CAP]
C30  0.1u  [C0402]
C31  0.1u  [C0402]
C32  0.1u  [C0402]
C33  0.1u  [C0402]
C34  0.1u  [C0402]
C35  0.1u  [C0402]
C36  0.1u  [C0402]
C37  0.1u  [C0402]
C38  22u  [C0805S-CAP]
C39  22u  [C0805S-CAP]
C40  0.1u  [C0402]
G1  32.768KHz  [爱普生晶振3.2×2.5mm]
L1  磁珠  [L0603]
L2  磁珠  [L0603]
L3  磁珠  [L0603]
L4  磁珠  [L0603]
P1  30PIN  [FH12-30S-0.5SH]
P2  Header 2  [HDR1X2]
R1  10K  [0603S-RES]
R2  0  [0603S-RES]
R3  4.7K  [0603S-RES]
R4  4.7K  [0603S-RES]
R5  4.7K  [0603S-RES]
R6  4.7K  [0603S-RES]
R7  4.7K  [0603S-RES]
R8  4.7K  [0603S-RES]
R9  0  [0603S-RES]
R10  6.04K-1%  [0603S-RES]
R11  200-1%  [0603S-RES]
RS1  22  [NC06-4]
RS2  22  [NC06-4]
RS3  22  [NC06-4]
U1  FX3_121_BUMP_0  [121_BGA_FX3]  (parts A,B,C,D,E,F,G,H of 8)
U2  M24M02-DRMN6TP  [SOIC127P600X175-8N]
U3  ATSHA204-MAH-DA-T  [UDFN]
V1  Red  [LED0805S]
Y1  19.2MHZ  [爱普生晶振3.2×2.5MM - 无源]

### Nets
AVDD: C13.2 C14.1 L2.2 U1.A7(AVDD)
GND: C1.1 C2.1 C3.2 C4.1 C5.2 C6.2 C7.1 C8.2 C9.2 C10.2 C11.2 C12.2 C13.1 C14.2 C15.2 C16.2 C17.2 C18.2 C19.2 C20.2 C21.2 C22.2 C23.2 C24.2 C26.1 C27.2 C29.2 C30.2 C31.2 C32.2 C33.2 C34.2 C35.2 C36.2 C37.2 C38.1 C39.1 C40.2 G1.2(gnd) P1.1 P1.13 P1.24 P1.25 R9.2 R10.2 R11.2 U1.A1(U3VSSQ) U1.A8(VSS12) U1.B2(FSLC0) U1.B4(FSLC1) U1.B7(AVSS) U1.B8(U2PLLVSSQ) U1.B9(U2AFEVSSQ) U1.D8(VSS5) U1.E2(VSS3) U1.E6(FSLC2) U1.G1(VSS1) U1.G11(VSS6) U1.K3(VSS10) U1.K4(VSS8) U1.L1(VSS2) U1.L2(VSS11) U1.L3(VSS9) U1.L6(VSS4) U1.L11(VSS7) U2.4(GND) U3.4(GND)
RXVDDQ: C39.2 C40.1 L3.2 U1.A2(U3RXVDDQ)
TXVDDQ: C26.2 C27.1 L4.2 U1.B5(U3TXVDDQ)
VCC(+3.3V): C3.1 C7.2 C15.1 C16.1 C17.1 C18.1 C19.1 C20.1 C29.1 C30.1 C31.1 C32.1 C33.1 C34.1 C35.1 C36.1 C37.1 G1.4(vcc) L1.2 P1.27 P1.28 P1.29 P1.30 R1.2 R3.2 R4.2 R5.1 R6.1 R7.2 R8.2 U1.B1(VIO4) U1.C11(VIO5) U1.E3(VIO3) U1.E10(VBAT) U1.F1(VIO2) U1.H11(VIO1_2) U1.L9(VIO1_1) U2.8(VCC) U3.8(VCC)
VCC(+5V): C8.1 U1.E11(VBUS)
VDD(+1.2V): C9.1 C10.1 C11.1 C12.1 C21.1 C22.1 C23.1 C24.1 C38.2 L2.1 L3.1 L4.1 U1.B10(VDD8) U1.C3(VDD2) U1.E9(VDD4) U1.F11(VDD5) U1.H1(VDD1) U1.J11(VDD7) U1.L5(VDD6) U1.L7(VDD3)  [project net V1p2]
CLK_OUT: G1.3(clk) U1.D6(CLKIN_32)
D0_IO: P1.18
D1_IO: P1.17
D2_IO: P1.16
D3_IO: P1.15
D4_IO: P1.14 RS3.7
D5_IO: P1.12 RS3.8
D6_IO: P1.11 RS2.5
D7_IO: P1.10 RS2.6
D8_IO: P1.9 RS2.7
D9_IO: P1.8 RS2.8
D10_IO: P1.7 RS1.5
D11_IO: P1.6 RS1.6
FRV_IO: P1.4 RS1.8
FX3_CTL0: P1.23 U1.K8(CTL0)  [also labelled RESET_IO]
FX3_CTL1: R2.2 U1.K7(CTL1)
FX3_CTL2: P1.26 U1.J7(CTL2)  [also labelled STAND_BY_IO]
FX3_CTL3: U1.H7(CTL3)
FX3_CTL4_SW: U1.G7(CTL4)
FX3_CTL5: U1.G6(CTL5)
FX3_CTL6: U1.K6(CTL6)
FX3_CTL7: U1.H8(CTL7)
FX3_CTL8: U1.G5(CTL8) V1.2(K)
FX3_CTL11: RS1.2 U1.J5(CTL11)
FX3_CTL12: RS1.1 U1.H5(CTL12)
FX3_CTL15: R5.2 U1.L8(INT_N_CTL15)
FX3_DQ0: RS3.2 U1.F10(DQ0)
FX3_DQ1: RS3.1 U1.F9(DQ1)
FX3_DQ2: RS2.4 U1.F7(DQ2)
FX3_DQ3: RS2.3 U1.G10(DQ3)
FX3_DQ4: RS2.2 U1.G9(DQ4)
FX3_DQ5: RS2.1 U1.F8(DQ5)
FX3_DQ6: RS1.4 U1.H10(DQ6)
FX3_DQ7: RS1.3 U1.H9(DQ7)
FX3_DQ8: U1.J10(DQ8)
FX3_DQ9: U1.J9(DQ9)
FX3_DQ10: U1.K11(DQ10)
FX3_DQ11: U1.L10(DQ11)
FX3_DQ12: U1.K10(DQ12)
FX3_DQ13: U1.K9(DQ13)
FX3_DQ14: U1.J8(DQ14)
FX3_DQ15: U1.G8(DQ15)
FX3_I2S_SCL: P1.21 R8.1 U1.D9(I2C-GPIO58_SCL) U2.6(SCL) U3.6(SCL)
FX3_I2S_SDA: P1.22 R7.1 U1.D10(I2C-GPIO59_SDA) U2.5(SDA) U3.5(SDA)
FX3_PCLK: RS3.4 U1.J6(PCLK)
FX3_RESET: C4.2 R6.2 U1.C5(RESET_N)
FX3_SPI-MISO_UART-TX: U1.C2(UART-TX_SPI-MISO)
FX3_SPI-MOSI_UART-RX: U1.D5(UART-RX_SPI-MOSI)
FX3_SPI-SCK_UART-RTS: U1.D4(UART-RTS_SPI-SCK)
FX3_SPI-SSN_UART-CTS: U1.C1(UART-CTS_SPI-SSN)
LIV_IO: P1.5 RS1.7
OTG_ID: R9.1 U1.C9(OTG_ID)
PCK_IO: P1.20 RS3.5
SST_N: C28.2 U1.A6(SSTXM)
SST_P: C25.2 U1.A5(SSTXP)
STB_IO: P1.2
TIGG_IO: P1.3 R2.1
USB_DS1_DM: U1.A10(DM)
USB_DS1_DP: U1.A9(DP)
USB_DS1_RXM: U1.A4(SSRXP)
USB_DS1_RXP: U1.A3(SSRXM)
USB_DS1_TXM: C28.1
USB_DS1_TXP: C25.1
XCK_IO: P1.19
XTAL_IN: C2.2 U1.C6(XTALIN) Y1.1(OSC1)
XTAL_OUT: C1.2 U1.C7(XTALOUT) Y1.2(OSC2)
NetC5_1: C5.1 C6.1 L1.1 U1.B6(CVDDQ)
NetP2_1: P2.1 R3.1
NetP2_2: P2.2 U1.G4(PMODE0)
NetR1_1: R1.1 V1.1(A)
NetR4_1: R4.1 U1.H4(PMODE1)
NetR10_1: R10.1 U1.C8(R_USB2)
NetR11_1: R11.1 U1.B3(R_USB3)

Not connected (* = marked no-connect by the designer): G1 1(ena); RS3 3 6; U1 A11(NC) B11(TRST_N) C4(I2S-MCLK) C10(TDO) D1(I2S-CLK) D2(I2S-SD) D3(I2S-WS) D7(CLKIN) D11(I2C-GPIO60_CHARGER-DETECT)* E1(DQ29) E4(DQ31) E5(DQ30) E7(TDI) E8(TMS) F2(GPIO45) F3(DQ27) F4(DQ24) F5(DQ28) F6(TCK) G2(DQ25) G3(DQ26) H2(DQ22) H3(DQ23) H6(CTL9) J1(DQ21) J2(DQ19) J3(DQ20) J4(DQ17) K1(DQ18) K2(DQ16) K5(CTL10) L4(PMODE2)*; U2 1(DU1) 2(DU2) 3(E2) 7(~{WC}); U3 1(NC) 2(NC) 3(NC) 7(NC)

### Layout directives
differential pair: SST_N, SST_P

### Notes on the sheet
- GPIO0
- GPIO1
- GPIO2
- CYUSB3014-BZXC
- GPIO3
- GPIO4
- GPIO5
- GPIO6
- GPIO7
- GPIO8
- GPIO9
- GPIO10
- GPIO11
- GPIO12
- GPIO13
- GPIO14
- GPIO15
- GPIO16
- GPIO17
- GPIO18
- GPIO21
- GPIO22
- GPIO24
- (near P2) GPIO28
- (near P2) GPIO29
- (near P2) GPIO30
- (near P2) GPIO31
- Labels drawn without touching a wire or pin: CLK_IN, FX3_CTL8, FX3_CTL9, FX3_CTL10, FX3_DQ16, FX3_DQ17, FX3_DQ18, FX3_DQ19, FX3_DQ20, FX3_DQ21, FX3_DQ22, FX3_DQ23, FX3_DQ24, FX3_DQ25, FX3_DQ26, FX3_DQ27, FX3_DQ28, FX3_DQ29, FX3_DQ30, FX3_DQ31, FX3_GPIO45, FX3_I2S_CLK, FX3_I2S_MCLK, FX3_I2S_SD, FX3_I2S_WS
- (in symbol FX3_121_BUMP_0, part A) P - PORT; SEC 1/7; VIO1
- (in symbol FX3_121_BUMP_0, part B) S0 - PORT; SEC 2/7
- (in symbol FX3_121_BUMP_0, part C) S1 - PORT; SEC 3/7
- (in symbol FX3_121_BUMP_0, part D) U - PORT; SEC 4/7; VBUS/
- (in symbol FX3_121_BUMP_0, part E) XTAL / CLK; SEC 5/7
- (in symbol FX3_121_BUMP_0, part F) MISC; SEC 6/7
- (in symbol FX3_121_BUMP_0, part G) POWER; SEC 7/7

### Library data of the parts
C1 C2 = CAP CER SMT 4.3pF 0805: 2. Manufacturere Part Number: C0805C439D5GACTU; 1. Manufacturer: Kemet; 8. Alternate Part: any; 7. Package / Case: 0805; 0. Do Not Install: DNI; 6. Mounting Type: SMT; 5. Supplier Link: http://www.digikey.com/product-detail/en/C0805C439D5GACTU/C0805C439D5GACTU-ND/2212763; 3. Supplier: Digi-Key; 4. Supplier Part Number: C0805C439D5GACTU-ND
C3 C29 = CAP: RC=1206
C4 = Cap: 50V/8.2u/0805; Value: 100n; Published: 8-Jun-2000; LatestRevisionDate: 17-Jul-2002; LatestRevisionNote: Re-released for DXP Platform.; PackageReference: RAD-0.3; Publisher: Altium Limited
C5 C6 C8-C28 C30-C40 = CAP0805: Capacitor; Value: 104; Published: 8-Jun-2000; Revision: July-2002: Re-released for DXP Platform.; Publisher: Altium Limited
C7 = CAP SMT 0.1uF 16V X7R: 2. Manufacturere Part Number: C0805C104K4RACTU; 1. Manufacturer: Kemet; 8. Alternate Part: any; 7. Package / Case: 0805; 6. Mounting Type: SMT; 5. Supplier Link: http://www.digikey.com/product-detail/en/C0805C104K4RACTU/399-1167-1-ND/411442; 3. Supplier: Digi-Key; 4. Supplier Part Number: 399-1167-1-ND
G1 = CTY4-B
L1-L4 = Inductor: Code_IEC: 1005; Value: 10mH; Published: 8-Jun-2000; LatestRevisionDate: 29-May-2009; LatestRevisionNote: IPC-7351 Footprint Added.; PackageReference: 0402-A; Publisher: Altium Limited; PackageDescription: Chip Inductor; Code_JEITA: 0402
P1 = Header 30: Header, 30-Pin; LatestRevisionDate: 17-Jul-2002; LatestRevisionNote: Re-released for DXP Platform.; Publisher: Altium Limited
P2 = Header 2: Header, 2-Pin; LatestRevisionDate: 17-Jul-2002; LatestRevisionNote: Re-released for DXP Platform.; Publisher: Altium Limited
R1 = Res2: Resistor; Published: 8-Jun-2000; LatestRevisionDate: 17-Jul-2002; LatestRevisionNote: Re-released for DXP Platform.; PackageReference: AXIAL-0.4; Publisher: Altium Limited; Value: 10K
R2-R11 = Res2: Resistor; Value: 10K; Published: 8-Jun-2000; LatestRevisionDate: 17-Jul-2002; LatestRevisionNote: Re-released for DXP Platform.; PackageReference: AXIAL-0.4; Publisher: Altium Limited
RS1-RS3 = RN4: Option 2 - Device: *; Option 2 - Spec: *; Option 3 - Device: *; Option 3 - Spec: *; Option 4 - Device: *; Option 4 - Spec: *; Option 5 - Device: *; Option 5 - Spec: *; Option 6 - Device: *; Option 6 - Spec: *; Option 7 - Device: *; Option 7 - Spec: *; Option 8 - Device: *; Option 8 - Spec: *
U2 = 24LC64-I/SN: IC EEPROM 64KBIT 400KHZ 8SOIC; Manufacturer: Microchip Technology; Format - Memory: EEPROMs - Serial; Memory Size: 64K (8K x 8); Interface: I2C, 2-Wire Serial; Voltage - Supply: 2.5 V ~ 5.5 V; Supplier 1: Digi-Key; Manufacturer Part Number: 24LC64-I/SN; RoHS: RoHS Compliant; Category: Integrated Circuits (ICs); Stock 1: 16323; Pricing 1: 1=0.38, 25=0.37, 100=0.35 (USD); Packaging: Tube; Memory Type: EEPROM; Speed: 400kHz; Operating Temperature: -40°C ~ 85°C (TA); Package / Case: 8-SOIC (0.154", 3.90mm Width); Supplier Device Package: 8-SOIC; ComponentLink1URL: http://www.microchip.com/mymicrochip/filehandler.aspx?ddocname=en011843; ComponentLink1Description: http://www.microchip.com/mymicrochip/filehandler.aspx?ddocname=en011843; Supplier Part Number 1: 24LC64-I/SN-ND
U3 = AT24C128
V1 = LED0: Typical INFRARED GaAs LED; Published: 8-Jun-2000; LatestRevisionDate: 08-Jul-2005; LatestRevisionNote: Mech Layer 1 removed.; PackageReference: LED-0; Publisher: Altium Limited
Y1 = XTAL 32.768KHZ: Crystal, CRYSTAL 32.768KHZ 6PF SMD; 2. Manufacturere Part Number: ABS07-120-32.768KHZ-T; 1. Manufacturer: Abracon; 6. Mounting Type: SMT; 9. Notes: 2 pad - Abracon ABS07-120-32.768KHZ-T, 4 pad - Abracon ABS25-32.768KHZ-6-T; 0. Do Not Install: DNI; 5. Supplier Link: http://www.digikey.com/product-detail/en/ABS07-120-32.768KHZ-T/535-11937-1-ND/3724046; 3. Supplier: Digi-Key; 4. Supplier Part Number: 535-11937-1-ND